# EAGLE design Drakula (EAGLE 9.6.2)
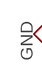
[diagram p0: schematic, sheet 1, part 1 of 3]
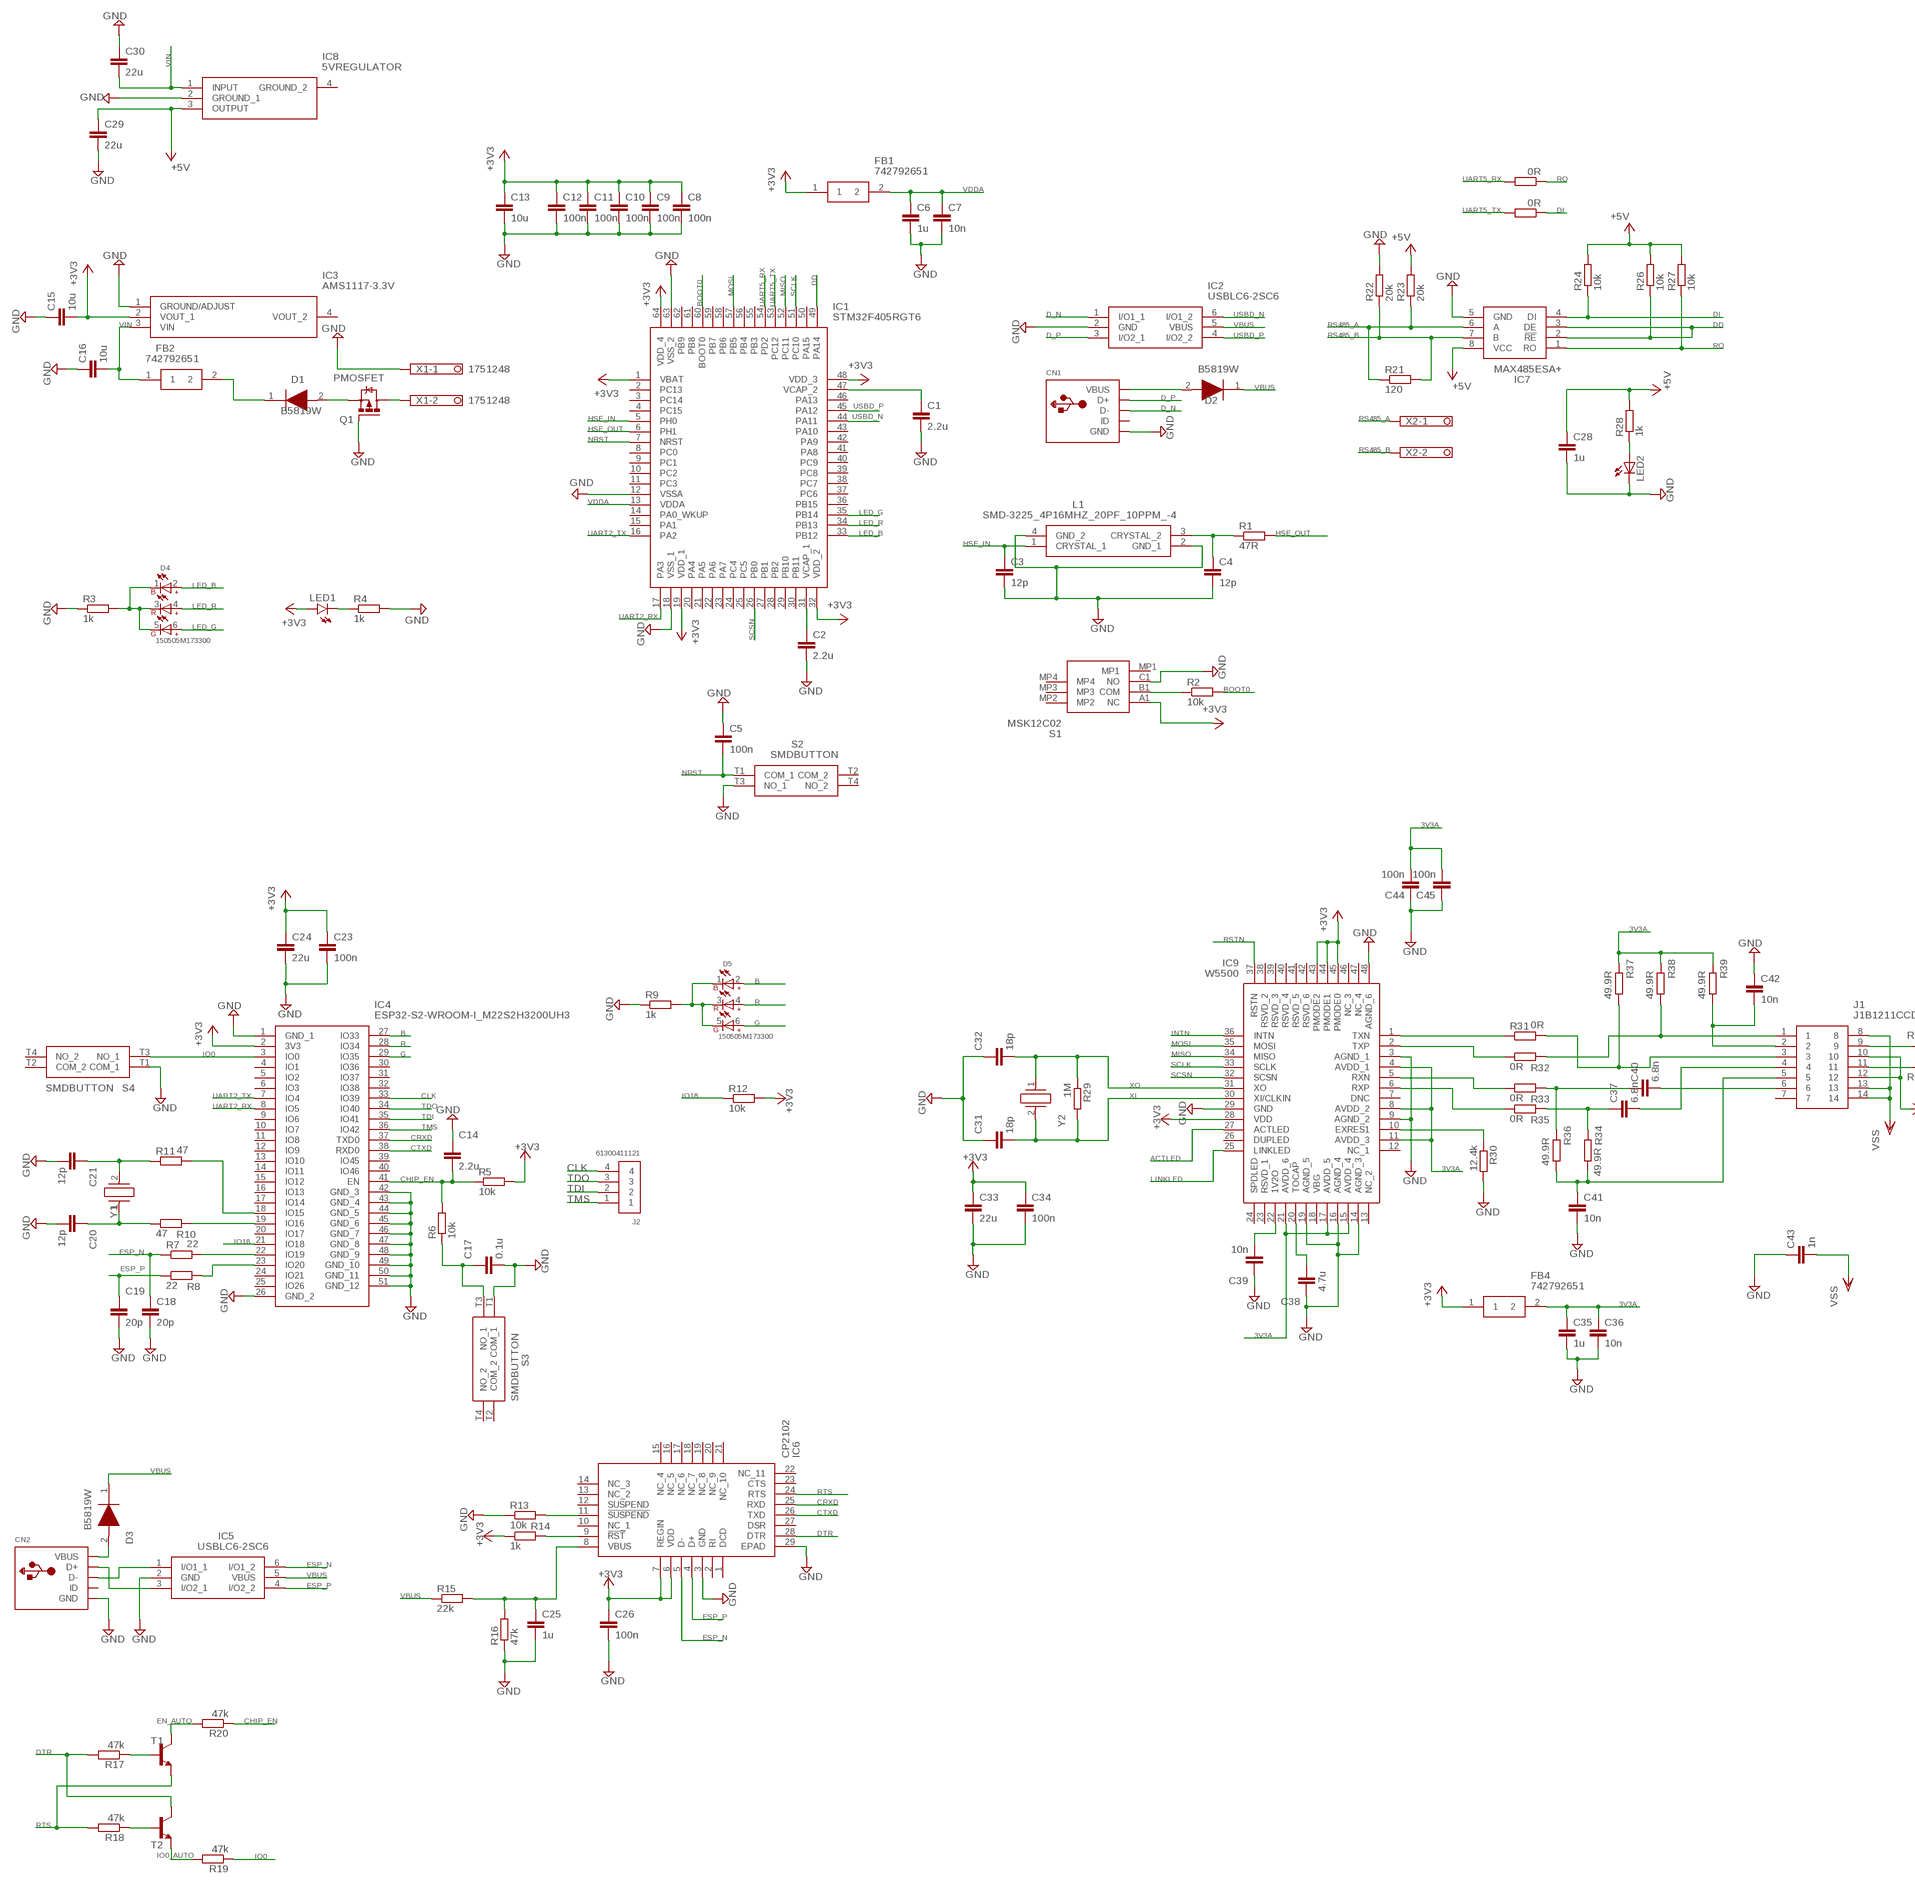
[diagram p1: schematic, sheet 1, part 2 of 3]
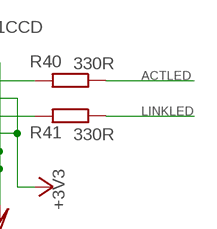
[diagram p2: schematic, sheet 1, part 3 of 3]

## Parts
C1  2.2u  C-EUC0603  [C0603]
C2  2.2u  C-EUC0603  [C0603]
C3  12p  C-EUC0603  [C0603]
C4  12p  C-EUC0603  [C0603]
C5  100n  C-EUC0603  [C0603]
C6  1u  C-EUC0603  [C0603]
C7  10n  C-EUC0603  [C0603]
C8  100n  C-EUC0603  [C0603]
C9  100n  C-EUC0603  [C0603]
C10  100n  C-EUC0603  [C0603]
C11  100n  C-EUC0603  [C0603]
C12  100n  C-EUC0603  [C0603]
C13  10u  C-EUC0603  [C0603]
C14  2.2u  C-EUC0603  [C0603]
C15  10u  C-EUC0603  [C0603]
C16  10u  C-EUC0603  [C0603]
C17  0.1u  C-EUC0603  [C0603]
C18  20p  C-EUC0603  [C0603]
C19  20p  C-EUC0603  [C0603]
C20  12p  C-EUC0603  [C0603]
C21  12p  C-EUC0603  [C0603]
C23  100n  C-EUC0603  [C0603]
C24  22u  C-EUC0603  [C0603]
C25  1u  C-EUC0603  [C0603]
C26  100n  C-EUC0603  [C0603]
C28  1u  C-EUC0603  [C0603]
C29  22u  C-EUC0805  [C0805]
C30  22u  C-EUC0805  [C0805]
C31  18p  C-EUC0603  [C0603]
C32  18p  C-EUC0603  [C0603]
C33  22u  C-EUC0805  [C0805]
C34  100n  C-EUC0805  [C0805]
C35  1u  C-EUC0603  [C0603]
C36  10n  C-EUC0603  [C0603]
C37  6.8n  C-EUC0603  [C0603]
C38  4.7u  C-EUC0603  [C0603]
C39  10n  C-EUC0603  [C0603]
C40  6.8n  C-EUC0603  [C0603]
C41  10n  C-EUC0603  [C0603]
C42  10n  C-EUC0603  [C0603]
C43  1n  C-EUC0603  [C0603]
C44  100n  C-EUC0603  [C0603]
C45  100n  C-EUC0603  [C0603]
CN1  USBMINIB  [USB-MINIB]
CN2  USBMINIB  [USB-MINIB]
D1  B5819W  [B5819W]
D2  B5819W  [B5819W]
D3  B5819W  [B5819W]
D4  150505M173300  WL-SFTW_5050_PLCC6_150505M173300  [WL-SFTW_5050_PLCC6]
D5  150505M173300  WL-SFTW_5050_PLCC6_150505M173300  [WL-SFTW_5050_PLCC6]
FB1  742792651  [BEADC1608X100N]
FB2  742792651  [BEADC1608X100N]
FB4  742792651  [BEADC1608X100N]
IC1  STM32F405RGT6  [STM32F405RTG6]
IC2  USBLC6-2SC6  [USBLC6]
IC3  AMS1117-3.3V  [SOT229P700X180-4N]
IC4  ESP32-S2-WROOM-I_M22S2H3200UH3  [ESP32S2]
IC5  USBLC6-2SC6  [USBLC6]
IC6  CP2102  [CP2102]
IC7  MAX485ESA+  [MAX485]
IC8  5VREGULATOR  [SOT23-5V]
IC9  W5500  [W5500]
J1  J1B1211CCD  [RJ45]
J2  61300411121  [61300411121]
L1  SMD-3225_4P16MHZ_20PF_10PPM_-4  [SMD3225_4P16MHZ20PF10PPM4085]
LED1  LEDCHIPLED_0603  [CHIPLED_0603]
LED2  LEDCHIPLED_0603  [CHIPLED_0603]
Q1  PMOSFET  PMOSFET_SOT23-GSD  [SOT23]
R1  47R  R-EU_R0603  [R0603]
R2  10k  R-EU_R0603  [R0603]
R3  1k  R-EU_R0805  [R0805]
R4  1k  R-EU_R0805  [R0805]
R5  10k  R-EU_R0603  [R0603]
R6  10k  R-EU_R0603  [R0603]
R7  22  R-EU_R0603  [R0603]
R8  22  R-EU_R0603  [R0603]
R9  1k  R-EU_R0805  [R0805]
R10  47  R-EU_R0603  [R0603]
R11  47  R-EU_R0603  [R0603]
R12  10k  R-EU_R0603  [R0603]
R13  10k  R-EU_R0805  [R0805]
R14  1k  R-EU_R0805  [R0805]
R15  22k  R-EU_R0805  [R0805]
R16  47k  R-EU_R0805  [R0805]
R17  47k  R-EU_R0805  [R0805]
R18  47k  R-EU_R0805  [R0805]
R19  47k  R-EU_R0805  [R0805]
R20  47k  R-EU_R0805  [R0805]
R21  120  R-EU_R0603  [R0603]
R22  20k  R-EU_R0603  [R0603]
R23  20k  R-EU_R0603  [R0603]
R24  10k  R-EU_R0603  [R0603]
R26  10k  R-EU_R0603  [R0603]
R27  10k  R-EU_R0603  [R0603]
R28  1k  R-EU_R0603  [R0603]
R29  1M  R-EU_R0603  [R0603]
R30  12.4k  R-EU_R0603  [R0603]
R31  0R  R-EU_R0603  [R0603]
R32  0R  R-EU_R0603  [R0603]
R33  0R  R-EU_R0603  [R0603]
R34  49.9R  R-EU_R0603  [R0603]
R35  0R  R-EU_R0603  [R0603]
R36  49.9R  R-EU_R0603  [R0603]
R37  49.9R  R-EU_R0603  [R0603]
R38  49.9R  R-EU_R0603  [R0603]
R39  49.9R  R-EU_R0603  [R0603]
R40  330R  R-EU_R0603  [R0603]
R41  330R  R-EU_R0603  [R0603]
R42  0R  R-EU_R0603  [R0603]
R43  0R  R-EU_R0603  [R0603]
S1  MSK12C02  [MSK12C02]
S2  SMDBUTTON  [SMDBUTTON]
S3  SMDBUTTON  [SMDBUTTON]
S4  SMDBUTTON  [SMDBUTTON]
T1  -NPN-SOT23-EBC  [SOT23-EBC]
T2  -NPN-SOT23-EBC  [SOT23-EBC]
X1  1751248  [1751248]
X2  1751248  [1751248]
Y1  FC-135R_32.7680KA-A0  [FC135R]
Y2  ABM3-25.000MHZ-B2-T  [ABM325000MHZB2T]

## Nets
3V3A: C35.1 C36.1 C44.2 C45.2 FB4.2 IC9.4(AVDD_1) IC9.8(AVDD_2) IC9.11(AVDD_3) IC9.15(AVDD_4) IC9.17(AVDD_5) IC9.21(AVDD_6) R37.2 R38.2 R39.2
+3V3: C8.1 C9.1 C10.1 C11.1 C12.1 C13.1 C15.2 C23.1 C24.1 C26.1 C33.1 C34.1 FB1.1 FB4.1 IC1.1(VBAT) IC1.19(VDD_1) IC1.32(VDD_2) IC1.48(VDD_3) IC1.64(VDD_4) IC3.2(VOUT_1) IC4.2(3V3) IC6.6(VDD) IC6.7(REGIN) IC9.28(VDD) IC9.43(PMODE2) IC9.44(PMODE1) IC9.45(PMODE0) J1.10 J1.12 LED1.A R5.2 R12.2 R14.1 S1.A1(NC)
+5V: C28.1 C29.1 IC7.8(VCC) IC8.3(OUTPUT) R23.2 R24.2 R26.2 R27.2 R28.2
ACTLED: IC9.27(ACTLED) R40.1
B: D5.2(B+) IC4.27(IO33)
BOOT0: IC1.60(BOOT0) R2.2
CHIP_EN: C14.2 IC4.41(EN) R5.1 R6.2 R20.1
CLK: IC4.33(IO39) J2.4
CRXD: IC4.37(TXD0) IC6.25(RXD)
CTXD: IC4.38(RXD0) IC6.26(TXD)
D_N: CN1.D- IC2.1(I/O1_1)
D_P: CN1.D+ IC2.3(I/O2_1)
DD: IC1.49(PA14) IC7.2(!RE) IC7.3(DE) R26.1
DI: IC7.4(DI) R24.1 R43.1
DTR: IC6.28(DTR) R17.2 T2.C
EN_AUTO: R20.2 T1.C
ESP_N: C18.1 IC5.6(I/O1_2) IC6.5(D-) R7.1
ESP_P: C19.1 IC5.4(I/O2_2) IC6.4(D+) R8.1
G: D5.6(G+) IC4.29(IO35)
GND: C1.2 C2.2 C3.2 C4.2 C5.1 C6.2 C7.2 C8.2 C9.2 C10.2 C11.2 C12.2 C13.2 C14.1 C15.1 C16.1 C17.2 C18.2 C19.2 C20.2 C21.2 C23.2 C24.2 C25.2 C26.2 C28.2 C29.2 C30.1 C31.1 C32.1 C33.2 C34.2 C35.2 C36.2 C38.1 C39.1 C41.2 C42.1 C43.1 C44.1 C45.1 CN1.GND CN2.GND IC1.12(VSSA) IC1.18(VSS_1) IC1.63(VSS_2) IC2.2(GND) IC3.1(GROUND/ADJUST) IC4.1(GND_1) IC4.26(GND_2) IC4.42(GND_3) IC4.43(GND_4) IC4.44(GND_5) IC4.45(GND_6) IC4.46(GND_7) IC4.47(GND_8) IC4.48(GND_9) IC4.49(GND_10) IC4.50(GND_11) IC4.51(GND_12) IC5.2(GND) IC6.3(GND) IC6.29(EPAD) IC7.5(GND) IC8.2(GROUND_1) IC9.3(AGND_1) IC9.9(AGND_2) IC9.14(AGND_3) IC9.16(AGND_4) IC9.19(AGND_5) IC9.29(GND) IC9.48(AGND_6) L1.2(GND_1) L1.4(GND_2) LED2.C Q1.1(G) R3.1 R4.2 R9.1 R13.1 R16.1 R22.2 R30.2 S1.C1(NO) S2.T3(NO_1) S3.T1(COM_1) S4.T1(COM_1) X1.1
HSE_IN: C3.1 IC1.5(PH0) L1.1(CRYSTAL_1)
HSE_OUT: IC1.6(PH1) R1.2
INTN: IC9.36(INTN)
IO0: IC4.3(IO0) R19.1 S4.T3(NO_1)
IO0_AUTO: R19.2 T2.E
IO18: IC4.21(IO18) R12.1
LED_B: D4.2(B+) IC1.33(PB12)
LED_G: D4.6(G+) IC1.35(PB14)
LED_R: D4.4(R+) IC1.34(PB13)
LINKLED: IC9.25(LINKLED) R41.1
MISO: IC1.52(PC11) IC9.34(MISO)
MOSI: IC1.57(PB5) IC9.35(MOSI)
N$1: Q1.3(D) X1.2
N$2: D1.1(K) FB2.2
N$3: D1.2(A) Q1.2(S)
N$4: D4.1(B-) D4.3(R-) D4.5(G-) R3.2
N$5: R2.1 S1.B1(COM)
N$6: LED1.C R4.1
N$8: C17.1 R6.1 S3.T3(NO_1)
N$10: CN2.D- IC5.1(I/O1_1)
N$11: CN2.D+ IC5.3(I/O2_1)
N$12: CN2.VBUS D3.2(A)
N$13: CN1.VBUS D2.2(A)
N$14: IC4.22(IO19) R7.2
N$15: IC4.23(IO20) R8.2
N$16: IC4.18(IO15) R11.2
N$17: C2.1 IC1.31(VCAP_1)
N$18: C1.1 IC1.47(VCAP_2)
N$19: IC4.19(IO16) R10.2
N$20: C4.1 L1.3(CRYSTAL_2) R1.1
N$21: C20.1 R10.1 Y1.1
N$22: C21.1 R11.1 Y1.2
N$23: C25.1 IC6.8(VBUS) R15.2 R16.2
N$24: IC6.11(!SUSPEND) R13.2
N$25: IC6.9(!RST) R14.2
N$26: D5.1(B-) D5.3(R-) D5.5(G-) R9.2
N$29: R17.1 T1.B
N$30: R18.1 T2.B
N$31: C39.2 IC9.22(1V2O)
N$32: C38.2 IC9.20(TOCAP)
N$33: LED2.A R28.1
N$34: IC9.10(EXRES1) R30.1
N$35: IC9.1(TXN) R31.1
N$36: IC9.2(TXP) R32.1
N$37: IC9.5(RXN) R33.1
N$38: IC9.6(RXP) R35.1
N$39: J1.1 R32.2 R38.1
N$40: J1.3 R31.2 R37.1
N$41: C40.2 J1.6
N$42: C37.2 J1.4
N$43: C37.1 R34.2 R35.2
N$44: C40.1 R33.2 R36.2
N$45: C41.1 J1.5 R34.1 R36.1
N$46: J1.9 R40.2
N$47: C42.2 J1.2 R39.1
N$48: J1.11 R41.2
NRST: C5.2 IC1.7(NRST) S2.T1(COM_1)
R: D5.4(R+) IC4.28(IO34)
RO: IC7.1(RO) R27.1 R42.1
RS485_A: IC7.6(A) R21.1 R23.1 X2.1
RS485_B: IC7.7(B) R21.2 R22.1 X2.2
RSTN: IC9.37(RSTN)
RTS: IC6.24(RTS) R18.2 T1.E
SCLK: IC1.51(PC10) IC9.33(SCLK)
SCSN: IC1.26(PB0) IC9.32(SCSN)
TDI: IC4.35(IO41) J2.2
TDO: IC4.34(IO40) J2.3
TMS: IC4.36(IO42) J2.1
UART2_RX: IC1.17(PA3) IC4.8(IO5)
UART2_TX: IC1.16(PA2) IC4.7(IO4)
UART5_RX: IC1.54(PD2) R42.2
UART5_TX: IC1.53(PC12) R43.2
USBD_N: IC1.44(PA11) IC2.6(I/O1_2)
USBD_P: IC1.45(PA12) IC2.4(I/O2_2)
VBUS: D2.1(K) D3.1(K) IC2.5(VBUS) IC5.5(VBUS) R15.1
VDDA: C6.1 C7.1 FB1.2 IC1.13(VDDA)
VIN: C16.2 C30.2 FB2.1 IC3.3(VIN) IC8.1(INPUT)
VSS: C43.2 J1.8 J1.13 J1.14
XI: C31.2 IC9.30(XI/CLKIN) R29.2 Y2.2
XO: C32.2 IC9.31(XO) R29.1 Y2.1
Unconnected: CN1.ID CN2.ID IC1.2(PC13) IC1.3(PC14) IC1.4(PC15) IC1.8(PC0) IC1.9(PC1) IC1.10(PC2) IC1.11(PC3) IC1.14(PA0_WKUP) IC1.15(PA1) IC1.20(PA4) IC1.21(PA5) IC1.22(PA6) IC1.23(PA7) IC1.24(PC4) IC1.25(PC5) IC1.27(PB1) IC1.28(PB2) IC1.29(PB10) IC1.30(PB11) IC1.36(PB15) IC1.37(PC6) IC1.38(PC7) IC1.39(PC8) IC1.40(PC9) IC1.41(PA8) IC1.42(PA9) IC1.43(PA10) IC1.46(PA13) IC1.50(PA15) IC1.55(PB3) IC1.56(PB4) IC1.58(PB6) IC1.59(PB7) IC1.61(PB8) IC1.62(PB9) IC3.4(VOUT_2) IC4.4(IO1) IC4.5(IO2) IC4.6(IO3) IC4.9(IO6) IC4.10(IO7) IC4.11(IO8) IC4.12(IO9) IC4.13(IO10) IC4.14(IO11) IC4.15(IO12) IC4.16(IO13) IC4.17(IO14) IC4.20(IO17) IC4.24(IO21) IC4.25(IO26) IC4.30(IO36) IC4.31(IO37) IC4.32(IO38) IC4.39(IO45) IC4.40(IO46) IC6.1(DCD) IC6.2(RI) IC6.10(NC_1) IC6.12(SUSPEND) IC6.13(NC_2) IC6.14(NC_3) IC6.15(NC_4) IC6.16(NC_5) IC6.17(NC_6) IC6.18(NC_7) IC6.19(NC_8) IC6.20(NC_9) IC6.21(NC_10) IC6.22(NC_11) IC6.23(CTS) IC6.27(DSR) IC8.4(GROUND_2) IC9.7(DNC) IC9.12(NC_1) IC9.13(NC_2) IC9.18(VBG) IC9.23(RSVD_1) IC9.24(SPDLED) IC9.26(DUPLED) IC9.38(RSVD_2) IC9.39(RSVD_3) IC9.40(RSVD_4) IC9.41(RSVD_5) IC9.42(RSVD_6) IC9.46(NC_3) IC9.47(NC_4) J1.7 S1.MP1 S1.MP2 S1.MP3 S1.MP4 S2.T2(COM_2) S2.T4(NO_2) S3.T2(COM_2) S3.T4(NO_2) S4.T2(COM_2) S4.T4(NO_2)

## Library data of the parts
C1-C21 C23-C26 C28-C45 = rcl:C-EU: CAPACITOR, European symbol; SPICEPREFIX: C
CN1 CN2 = adafruit:USB: USB Connectors USBMINIB - Surface Mount Female Mini-B USB Connector 4UConnector: 06564 By microbuilder.eu Thru-hole RA Female Mini-B USB Connector 4UConnector: 18732 By ladyada.net
D1-D3 = B5819W:B5819W: 40V 1A 600mV @ 1A SOD-123 Schottky Barrier Diodes (SBD) Source: Datasheet <https://datasheet.lcsc.com/szlcsc/Changjiang-Electronics-Tech-CJ-B5819W_C8598.pdf>; DESCRIPTION: 40V 1A 600mV @ 1A SOD-123 Schottky Barrier Diodes (SBD); HEIGHT: 1.25mm; MANUFACTURER_NAME: Changjiang Electronics Tech (CJ); MANUFACTURER_PART_NUMBER: B5819W
D4 D5 = Wurth_LEDs_WL-SFTW:WL-SFTW_5050_PLCC6: WL-SFTW SMT Full-color TOP LED Waterclear Characteristics Low energy consumption High reliability Low current requirement Fast switching No UV/IR radiation High brightness RGB individual control Compact package outline LED with Black surface Applications Flash light Switch indicators Equipment indicators Accent and decorative lighting Electronic signage Video displays Backlight for LCDs, PDAs and TVs Oven, microwave Street lighting Ideal for lateral coupling in light guides <https://www.we-online.com/catalog/media/o14903v209%20Family_WL-SFTW-neu.jpg> Details see: www.we-online.com/catalog/WL-SFTW <www.we-online.com/catalog/WL-SFTW/?utm_source=eagle_model&utm_medium=description_link&utm_campaign=eisos_eagle> Updated by Ella 2022-06-20 2022(C) Wurth Elektronik; CHIP-TECHNOLOGY: AlInGaP + InGaN; DATASHEET-URL: https://www.we-online.com/redexpert/spec/150505M173300?ae; DOMINANT-WAVELENGTH: 625nm@Red / 520nm@Green / 470nm@Blue; EMITTING-COLOR: Red & Green & Blue; FORWARD-VOLTAGE: 2V@Red / 3.2V@Green / 3.2V@Blue; LUMINOUS-INTENSITY: 800nm@Red / 1300mcd@Green / 350mcd@Blue; MOUNT: SMT; PART-NUMBER: 150505M173300; PEAK-WAVELENGTH: 635nm@Red / 515nm@Green / 465nm@Blue; VIEWING-ANGLE: 120°
FB1 FB2 FB4 = ferrite bead:742792651: WE-CBF Ferrite Bead 0603 600Ohm 1000mA WE-CBF Ferrite Bead 0603 600Ohm 1000mA Source: Datasheet <https://datasheet.datasheetarchive.com/originals/distributors/Datasheets_SAMA/48062ffb9caf49acf8bdc538db0cfb17.pdf>; DESCRIPTION: WE-CBF Ferrite Bead 0603 600Ohm 1000mA WE-CBF Ferrite Bead 0603 600Ohm 1000mA; HEIGHT: 1mm; MANUFACTURER_NAME: Wurth Elektronik; MANUFACTURER_PART_NUMBER: 742792651; MOUSER_PART_NUMBER: 710-742792651; MOUSER_PRICE-STOCK: https://www.mouser.co.uk/ProductDetail/Wurth-Elektronik/742792651?qs=5twSNpOB8IDs0LGakhqBZQ%3D%3D
IC1 = STM32F405RGT6:STM32F405RGT6: MCU 32-Bit, ARM Cortex M4, 1MB Flash STMicroelectronics STM32F405RGT6, 32bit ARM Cortex M4F Microcontroller, 168MHz, 1024 kB Flash, 64-Pin LQFP Source: Datasheet <http://www.st.com/web/en/resource/technical/document/datasheet/DM00037051.pdf>; ARROW_PART_NUMBER: STM32F405RGT6; ARROW_PRICE-STOCK: https://www.arrow.com/en/products/stm32f405rgt6/stmicroelectronics?region=nac; DESCRIPTION: MCU 32-Bit, ARM Cortex M4, 1MB Flash STMicroelectronics STM32F405RGT6, 32bit ARM Cortex M4F Microcontroller, 168MHz, 1024 kB Flash, 64-Pin LQFP; HEIGHT: 1.6mm; MANUFACTURER_NAME: STMicroelectronics; MANUFACTURER_PART_NUMBER: STM32F405RGT6; MOUSER_PART_NUMBER: 511-STM32F405RGT6; MOUSER_PRICE-STOCK: https://www.mouser.co.uk/ProductDetail/STMicroelectronics/STM32F405RGT6?qs=Z8%252BeY1k3TIKgj7QWsYGpQw%3D%3D
IC2 IC5 = USBLC6-2SC6:USBLC6-2SC6: TVS Diode Array Uni-Directional USBLC6-2SC6 17V, SOT-23 6-Pin Source: Datasheet <http://www.st.com/st-web-ui/static/active/en/resource/technical/document/datasheet/CD00050750.pdf>; ARROW_PART_NUMBER: USBLC6-2SC6; ARROW_PRICE-STOCK: https://www.arrow.com/en/products/usblc6-2sc6/stmicroelectronics?region=nac; DESCRIPTION: TVS Diode Array Uni-Directional USBLC6-2SC6 17V, SOT-23 6-Pin; HEIGHT: 1.45mm; MANUFACTURER_NAME: STMicroelectronics; MANUFACTURER_PART_NUMBER: USBLC6-2SC6; MOUSER_PART_NUMBER: 511-USBLC6-2SC6; MOUSER_PRICE-STOCK: https://www.mouser.co.uk/ProductDetail/STMicroelectronics/USBLC6-2SC6?qs=po45yt2pPpu%2FhNIlwQdTlg%3D%3D
IC3 = ams1117-3.3v:AMS1117-3.3V: 1A LOW DROPOUT VOLTAGE REGULATOR, SOT-223 Source: Datasheet <http://www.advanced-monolithic.com/pdf/ds1117.pdf>; DESCRIPTION: 1A LOW DROPOUT VOLTAGE REGULATOR, SOT-223; HEIGHT: 1.8mm; MANUFACTURER_NAME: Advanced Monolithic Systems; MANUFACTURER_PART_NUMBER: ams1117-3.3v
IC4 = ESP32-S2-WROOM-I_M22S2H3200UH3:ESP32-S2-WROOM-I_M22S2H3200UH3: WiFi Modules (802.11) Module ESP32-S2 WROOM IPEX ANT Source: Datasheet <https://www.espressif.com/sites/default/files/documentation/esp32-s2-wroom_esp32-s2-wroom-i_datasheet_en.pdf>; DESCRIPTION: WiFi Modules (802.11) Module ESP32-S2 WROOM IPEX ANT; HEIGHT: 3.45mm; MANUFACTURER_NAME: Espressif Systems; MANUFACTURER_PART_NUMBER: ESP32-S2-WROOM-I(M22S2H3200UH3Q0); MOUSER_PART_NUMBER: 356-ESP32S2WRMI320UH; MOUSER_PRICE-STOCK: https://www.mouser.co.uk/ProductDetail/Espressif-Systems/ESP32-S2-WROOM-IM22S2H3200UH3Q0?qs=vHuUswq2%252BswK%2FNdFP9puyg%3D%3D
IC6 = CP2102:CP2102: USB Interface IC Source: Datasheet <https://componentsearchengine.com/Datasheets/1/CP2102.pdf>; DESCRIPTION: USB Interface IC; HEIGHT: 1mm; MANUFACTURER_NAME: Silicon Labs; MANUFACTURER_PART_NUMBER: CP2102; MOUSER_PART_NUMBER: 634-CP2102; MOUSER_PRICE-STOCK: https://www.mouser.co.uk/ProductDetail/Silicon-Labs/CP2102?qs=ucY0lxHzU7615lOm95XT0w%3D%3D
IC7 = MAX485ESA+:MAX485ESA+: MAX485ESA+, Line Transceiver, RS-485, RS-422 2.5 Mbit/s Differential, 4.75 5.25 V, 8-Pin SOIC Source: Datasheet <http://datasheets.maximintegrated.com/en/ds/MAX1487-MAX491.pdf>; ARROW_PART_NUMBER: MAX485ESA+; ARROW_PRICE-STOCK: https://www.arrow.com/en/products/max485esa/maxim-integrated?region=nac; DESCRIPTION: MAX485ESA+, Line Transceiver, RS-485, RS-422 2.5 Mbit/s Differential, 4.75 5.25 V, 8-Pin SOIC; HEIGHT: 1.75mm; MANUFACTURER_NAME: Maxim Integrated; MANUFACTURER_PART_NUMBER: MAX485ESA+; MOUSER_PART_NUMBER: 700-MAX485ESA; MOUSER_PRICE-STOCK: https://www.mouser.co.uk/ProductDetail/Maxim-Integrated/MAX485ESA%2b?qs=1THa7WoU59HHuBnHtoz5mw%3D%3D
IC8 = NCV2931AST-5T3G:5VREGULATOR: LDO Regulator Pos 5V 0.1A Automotive 4-Pin(3+Tab) SOT-223 T/R Source: Datasheet <https://www.mouser.com/datasheet/2/308/LM2931-D-30111.pdf>; DESCRIPTION: LDO Regulator Pos 5V 0.1A Automotive 4-Pin(3+Tab) SOT-223 T/R; HEIGHT: 1.8mm; MANUFACTURER_NAME: onsemi; MANUFACTURER_PART_NUMBER: NCV2931AST-5T3G; MOUSER_PART_NUMBER: 863-NCV2931AST-5T3G; MOUSER_PRICE-STOCK: https://www.mouser.co.uk/ProductDetail/ON-Semiconductor/NCV2931AST-5T3G?qs=8sOby8ZxZLGq7jO3LofrqA%3D%3D
IC9 = W5500:W5500: Ethernet ICs 3in1 Enet Controller TCP/IP +MAC+PHY Source: Datasheet <http://wizwiki.net/wiki/lib/exe/fetch.php?media=products:w5500:w5500_ds_v106e_141230.pdf>; DESCRIPTION: Ethernet ICs 3in1 Enet Controller TCP/IP +MAC+PHY; HEIGHT: 1.6mm; MANUFACTURER_NAME: WIZnet Inc; MANUFACTURER_PART_NUMBER: W5500; MOUSER_PART_NUMBER: 950-W5500; MOUSER_PRICE-STOCK: https://www.mouser.co.uk/ProductDetail/WIZnet/W5500?qs=2vh%252B45pPFtzthUpYPd4pqA%3D%3D
J1 = rj45:J1B1211CCD: Modules Accessories RJ-45 w/ Transformer Connector /CETUS Source: Datasheet <http://wizwiki.net/wiki/lib/exe/fetch.php?media=products:wiz550web:wiz550webds_kr:j1b1211ccd.pdf>; DESCRIPTION: Modules Accessories RJ-45 w/ Transformer Connector /CETUS; HEIGHT: 13.6mm; MANUFACTURER_NAME: WIZnet Inc; MANUFACTURER_PART_NUMBER: J1B1211CCD; MOUSER_PART_NUMBER: 950-J1B1211CCD; MOUSER_PRICE-STOCK: https://www.mouser.co.uk/ProductDetail/WIZnet/J1B1211CCD?qs=6pHq9bjOlanFLUlTDcmBeQ%3D%3D
J2 = Headers:61300411121: CONN HEADER VERT 4POS 2.54MM Manufacturer's datasheet <https://katalog.we-online.de/em/datasheet/6130xx11121.pdf>; CREATED_BY: PCBLayout.com; DIGI_KEY_PART_NUMBER: 732-5317-ND; MANUFACTURER: Wurth Electronics Inc.; MPN: 61300411121
L1 = SMD-3225_4p_clock:SMD-3225_4P16MHZ_20PF_10PPM_-4: SMD-3225_4P16MHZ 20PF 10PPM -40~+85 Source: Datasheet <https://datasheet.lcsc.com/szlcsc/Zhejiang-Abel-Elec-SMD-3225-4P-16MHz-20pF-10ppm-40-85_C164049.pdf>; DESCRIPTION: SMD-3225_4P16MHZ 20PF 10PPM -40~+85; HEIGHT: 0.8mm; MANUFACTURER_NAME: TAE(Zhejiang Abel Elec); MANUFACTURER_PART_NUMBER: SMD-3225_4P16MHZ 20PF 10PPM -40~+85℃
LED1 = led:LED: LED
LED2 = adafruit:LED: LED
Q1 = Transistor:PMOSFET: P-Channel MOSFET - Generic; CATEGORY: Transistor; SUB-CATEGORY: MOSFET; TYPE: P-Channel
R1-R24 R26-R43 = rcl:R-EU_: RESISTOR, European symbol; SPICEPREFIX: R
S1 = MSK12C02 SPDT:MSK12C02: SMD Toggle Switches Source: Datasheet <https://shouhan.en.made-in-china.com/product/xsMEmqgOAXWB/China-Slide-Switch-Msk12c02-Slide-Switch-on-off-2-Position-1p2t-Spdt-Miniature-Horizontal-SMD-7p-Slide-Switch.html>; DESCRIPTION: SMD Toggle Switches; HEIGHT: 1.4mm; MANUFACTURER_NAME: Shou Han; MANUFACTURER_PART_NUMBER: MSK12C02
S2-S4 = SPST Button SMD:SMDBUTTON: Tactile Switches Surface mount tact 6.6mm /4.3mm / Brown Source: Datasheet <https://www.mouser.com/datasheet/2/26/ADTS6-ADTSM-KTSC6-263747-1158247.pdf>; DESCRIPTION: Tactile Switches Surface mount tact 6.6mm /4.3mm / Brown; HEIGHT: 4.3mm; MANUFACTURER_NAME: Apem; MANUFACTURER_PART_NUMBER: ADTSM61NVTR; MOUSER_PART_NUMBER: 642-ADTSM61NVTR; MOUSER_PRICE-STOCK: https://www.mouser.co.uk/ProductDetail/Apem/ADTSM61NVTR?qs=iGLABakYCr8tE6uSJ2f%2FWA%3D%3D
T1 T2 = transistor:*-NPN-: NPN Transistror BF959 corrected 2008.03.06
X1 X2 = con-phoenix-350:1751248: MKDS 1/ 2-3,5 Printklemme Nennstrom: 10 A Bemessungsspannung: 160 V Raster: 3,5 mm Polzahl: 2 Montageart: Löten Anschlussart: Schraubanschluss Anschlussrichtung vom Leiter zur Platine: 0° Source: http://eshop.phoenixcontact.com .. 1751248.pdf; OC_FARNELL: unknown; OC_NEWARK: unknown
Y1 = FC-135R_32.7680KA-A0:FC-135R_32.7680KA-A0: CRYSTAL 32.7680 KHZ 12.5PF SMD Source: Datasheet <https://support.epson.biz/td/api/doc_check.php?dl=brief_FC-135R&lang=en>; ARROW_PART_NUMBER: FC-135R 32.7680KA-A0; ARROW_PRICE-STOCK: https://www.arrow.com/en/products/fc-135r32.7680ka-a0/epson-electronics-america; DESCRIPTION: CRYSTAL 32.7680 KHZ 12.5PF SMD; HEIGHT: 0.9mm; MANUFACTURER_NAME: Epson Timing; MANUFACTURER_PART_NUMBER: FC-135R 32.7680KA-A0; MOUSER_PART_NUMBER: 732-5R32.7680KA-A0; MOUSER_PRICE-STOCK: https://www.mouser.co.uk/ProductDetail/Epson-Timing/FC-135R-327680KA-A0?qs=f9yNj16SXrJRNSRyvSQAPQ%3D%3D
Y2 = ABM3-25.000MHZ-B2-T:ABM3-25.000MHZ-B2-T: Crystals +/-20ppm 25MHZ Source: Datasheet <https://datasheet.datasheetarchive.com/originals/distributors/SFDatasheet-0/sf-000246.pdf>; ARROW_PART_NUMBER: ABM3-25.000MHZ-B2-T; ARROW_PRICE-STOCK: https://www.arrow.com/en/products/abm3-25.000mhz-b2-t/abracon; DESCRIPTION: Crystals +/-20ppm 25MHZ; HEIGHT: 1.3mm; MANUFACTURER_NAME: ABRACON; MANUFACTURER_PART_NUMBER: ABM3-25.000MHZ-B2-T; MOUSER_PART_NUMBER: 815-ABM3-25-B2-T; MOUSER_PRICE-STOCK: https://www.mouser.co.uk/ProductDetail/ABRACON/ABM3-25000MHZ-B2-T?qs=GgB7MJ%2FTIsQBQ7HNZGW3Hg%3D%3D

## Board
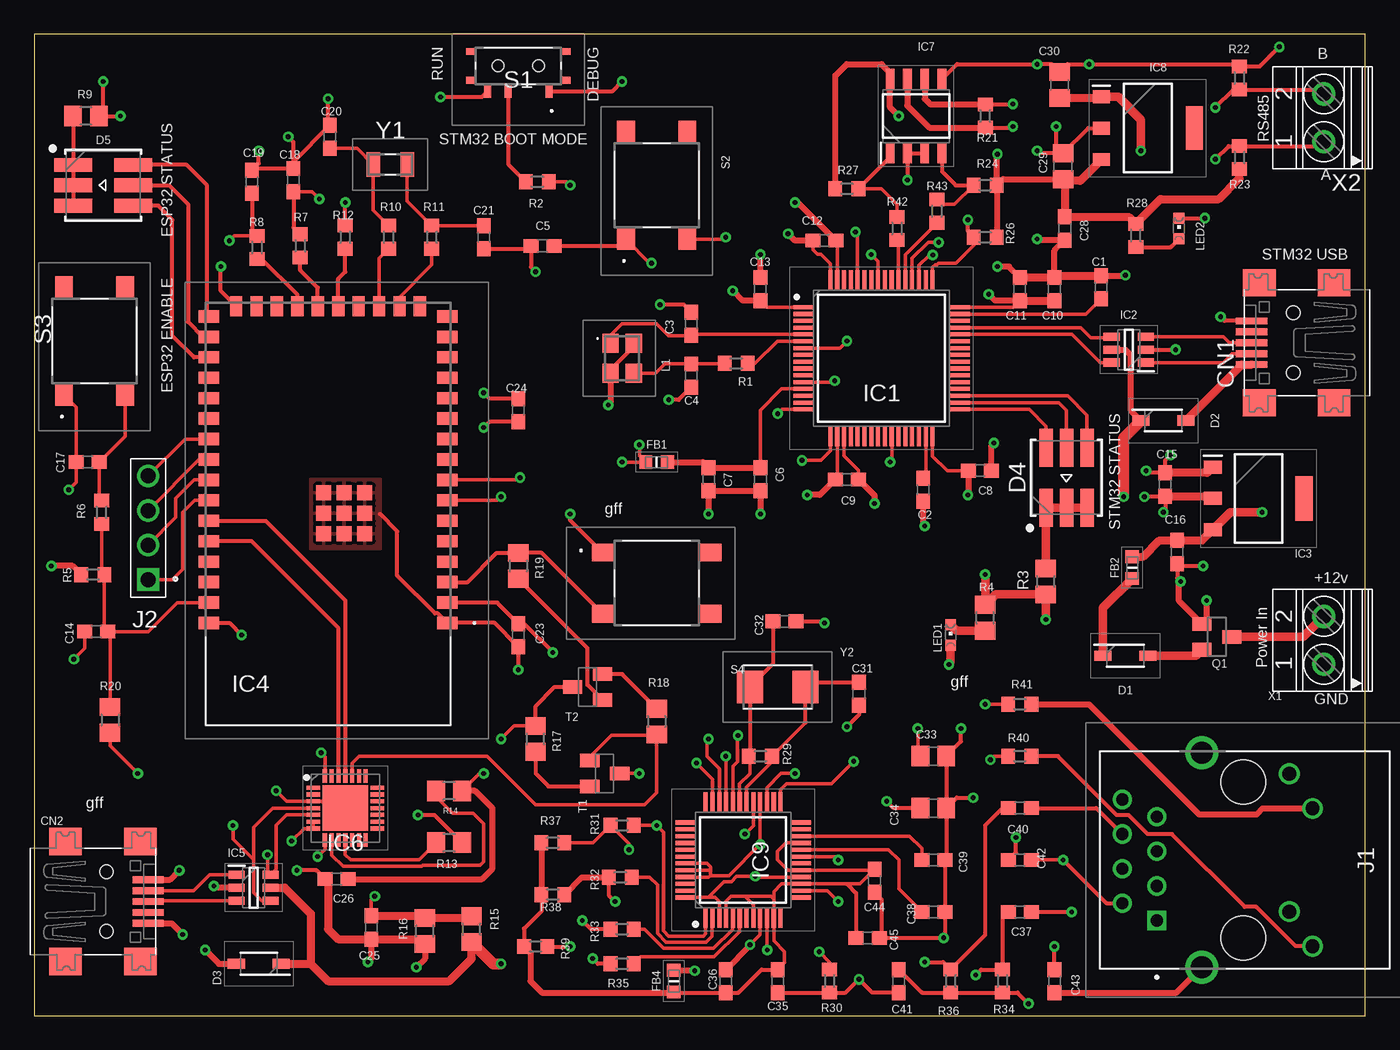
[diagram p3: board, top side]
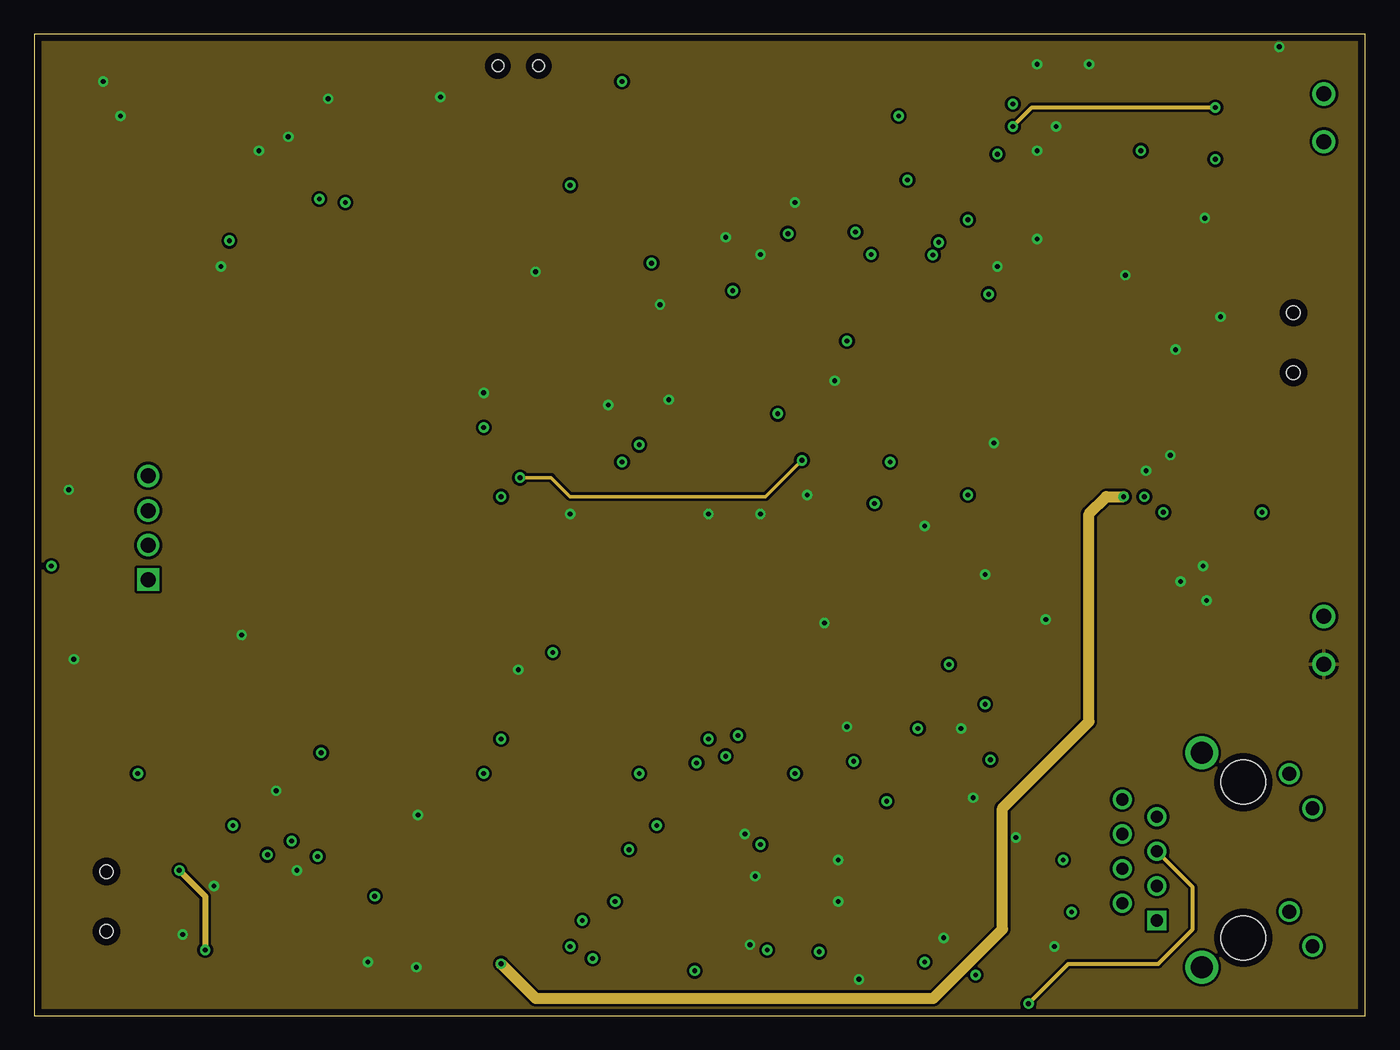
[diagram p4: board, inner layer Route2]
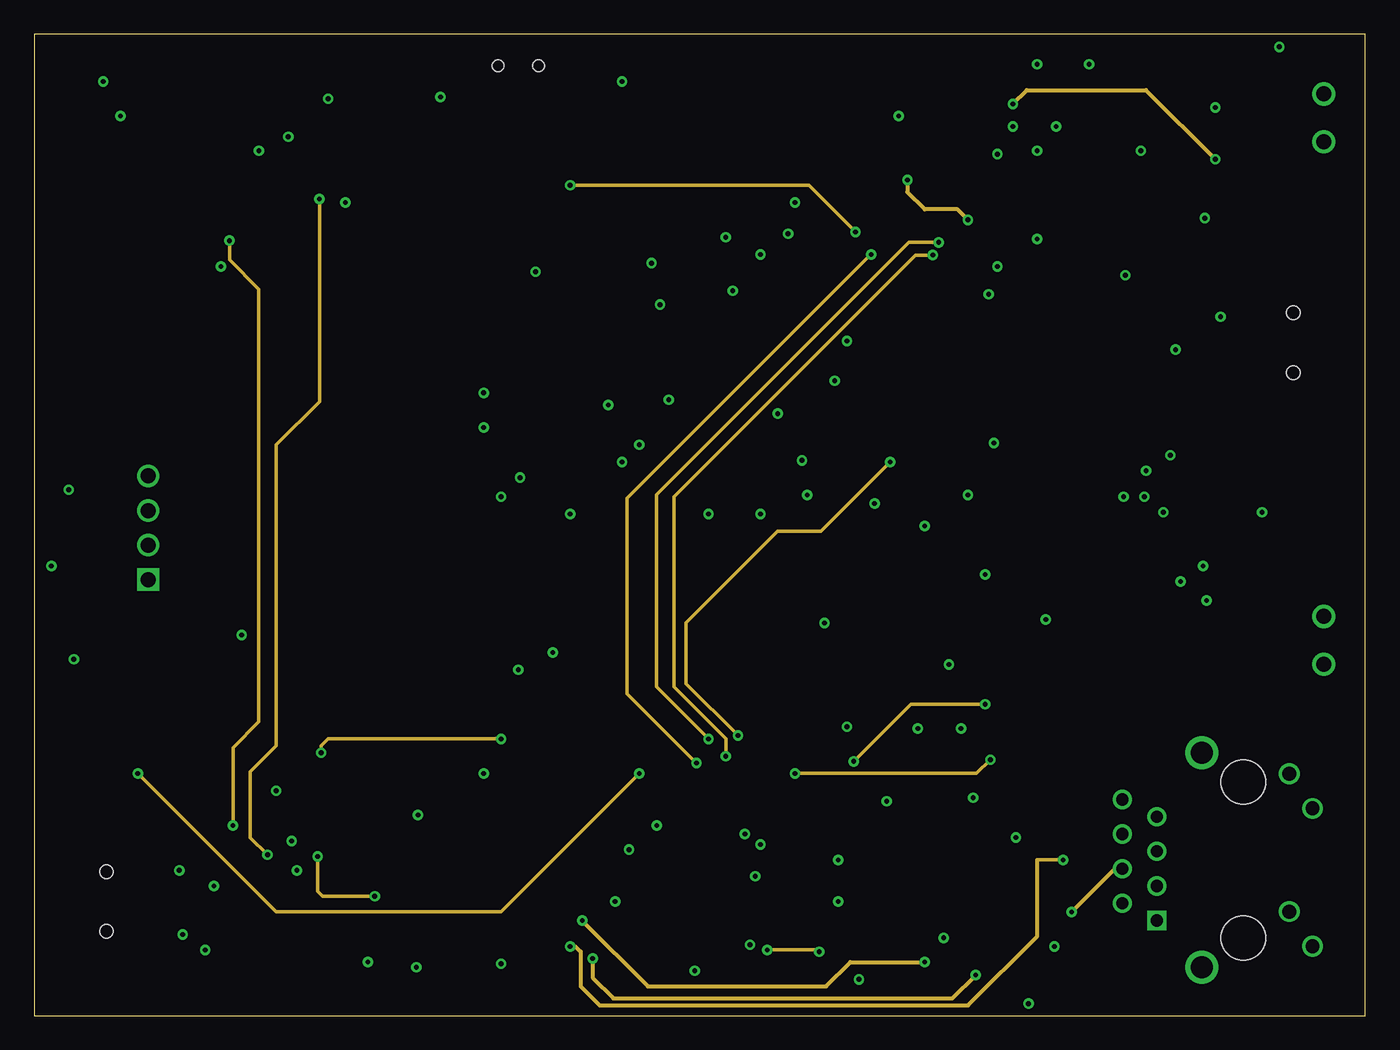
[diagram p5: board, inner layer Route15]
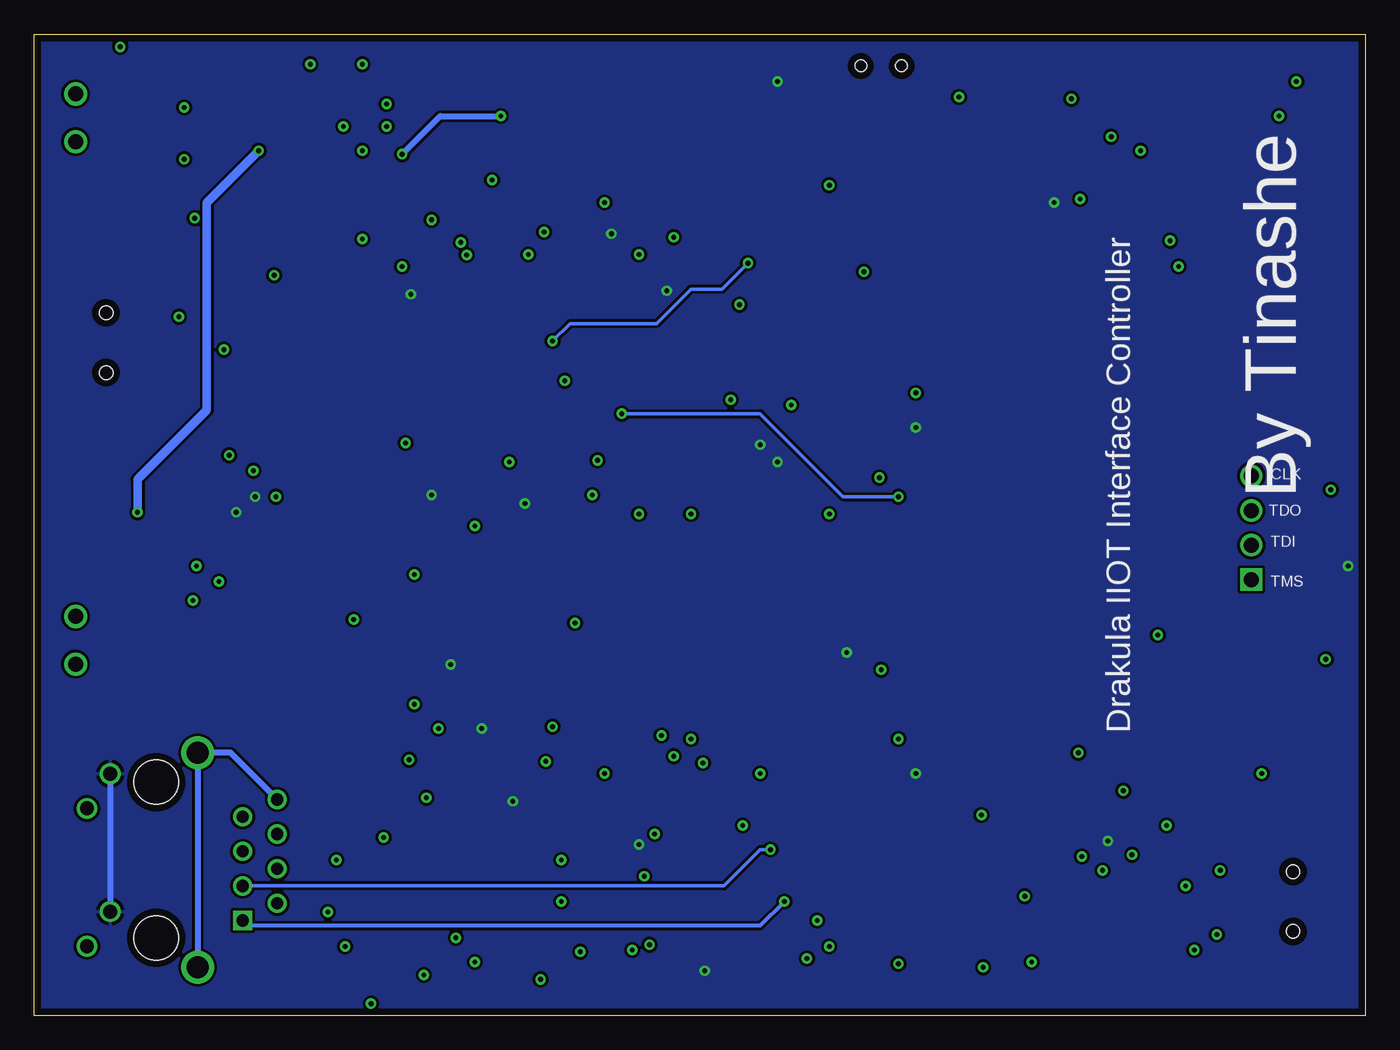
[diagram p6: board, bottom side, seen from below]

Size 97.77 x 72.06 mm. Coordinates in mm from the lower left corner, seen from the top.
Outline: 0,0 97.77,0 97.77,72.06 0,72.06 0,0
Copper layers (1+2*15+16): Top 0.035mm / dielectric 1.5mm / Route2 0.035mm / dielectric 0.15mm / Route15 0.035mm / dielectric 0.2mm / Bottom 0.035mm
Design rules "default *": minimum track width 0.2mm, minimum drill 0.35mm, track to track 0.2mm, track to pad 0.2mm, pad to pad 0.2mm, via to via 0.2mm, smd to smd 0.2mm, copper to edge 20mil, drill to drill 0.2mm, minimum pad ring 10mil, minimum via ring 8mil, stop-mask expansion 4mil, vias tented up to drill 0mil, thermal gap 10mil

### Footprints (pad centres in the part's own frame; a part is rotated, then mirrored left to right if it is on the bottom)
C0603 = smd 1.1 x 1: 1 -0.85,0; 2 0.85,0
C0805 = smd 1.3 x 1.5: 1 -0.95,0; 2 0.95,0
USB-MINIB = smd 0.5 x 2.308: D+ 0,4.064; D- -0.8,4.064; GND 1.6,4.064; ID 0.8,4.064; VBUS -1.6,4.064 | smd 2 x 2.4: GND1 -4.4,-2; GND2 -4.4,3.5; GND3 4.4,3.5; GND4 4.4,-2 | hole 1: -2.2,1; 2.2,1
B5819W = smd 1.25 x 0.75: 1 -1.65,0; 2 1.65,0
WL-SFTW_5050_PLCC6 = smd 2.8 x 1: 1 -2.2,1.5; 2 2.2,1.5; 3 -2.2,0; 4 2.2,0; 5 -2.2,-1.5; 6 2.2,-1.5
BEADC1608X100N = smd 0.95 x 1: 1 -0.8,0; 2 0.8,0
STM32F405RTG6 = smd 1.475 x 0.3: 1 -5.738,3.75; 2 -5.738,3.25; 3 -5.738,2.75; 4 -5.738,2.25; 5 -5.738,1.75; 6 -5.738,1.25; 7 -5.738,0.75; 8 -5.738,0.25; 9 -5.738,-0.25; 10 -5.738,-0.75; 11 -5.738,-1.25; 12 -5.738,-1.75; 13 -5.738,-2.25; 14 -5.738,-2.75; 15 -5.738,-3.25; 16 -5.738,-3.75; 33 5.738,-3.75; 34 5.738,-3.25; 35 5.738,-2.75; 36 5.738,-2.25; 37 5.738,-1.75; 38 5.738,-1.25; 39 5.738,-0.75; 40 5.738,-0.25; 41 5.738,0.25; 42 5.738,0.75; 43 5.738,1.25; 44 5.738,1.75; 45 5.738,2.25; 46 5.738,2.75; 47 5.738,3.25; 48 5.738,3.75 | smd 0.3 x 1.475: 17 -3.75,-5.738; 18 -3.25,-5.738; 19 -2.75,-5.738; 20 -2.25,-5.738; 21 -1.75,-5.738; 22 -1.25,-5.738; 23 -0.75,-5.738; 24 -0.25,-5.738; 25 0.25,-5.738; 26 0.75,-5.738; 27 1.25,-5.738; 28 1.75,-5.738; 29 2.25,-5.738; 30 2.75,-5.738; 31 3.25,-5.738; 32 3.75,-5.738; 49 3.75,5.738; 50 3.25,5.738; 51 2.75,5.738; 52 2.25,5.738; 53 1.75,5.738; 54 1.25,5.738; 55 0.75,5.738; 56 0.25,5.738; 57 -0.25,5.738; 58 -0.75,5.738; 59 -1.25,5.738; 60 -1.75,5.738; 61 -2.25,5.738; 62 -2.75,5.738; 63 -3.25,5.738; 64 -3.75,5.738
USBLC6 = smd 1.2 x 0.6: 1 -1.25,0.95; 2 -1.25,0; 3 -1.25,-0.95; 4 1.25,-0.95; 5 1.25,0; 6 1.25,0.95
SOT229P700X180-4N = smd 1.3 x 0.95: 1 -3.35,2.29; 2 -3.35,0; 3 -3.35,-2.29 | smd 1.3 x 3.25: 4 3.35,0
ESP32S2 = smd 1.5 x 0.9: 1 -8.75,8; 2 -8.75,6.5; 3 -8.75,5; 4 -8.75,3.5; 5 -8.75,2; 6 -8.75,0.5; 7 -8.75,-1; 8 -8.75,-2.5; 9 -8.75,-4; 10 -8.75,-5.5; 11 -8.75,-7; 12 -8.75,-8.5; 13 -8.75,-10; 14 -8.75,-11.5; 15 -8.75,-13; 16 -8.75,-14.5; 27 8.75,-14.5; 28 8.75,-13; 29 8.75,-11.5; 30 8.75,-10; 31 8.75,-8.5; 32 8.75,-7; 33 8.75,-5.5; 34 8.75,-4; 35 8.75,-2.5; 36 8.75,-1; 37 8.75,0.5; 38 8.75,2; 39 8.75,3.5; 40 8.75,5; 41 8.75,6.5; 42 8.75,8 | smd 0.9 x 1.5: 17 -6.75,-15.25; 18 -5.25,-15.25; 19 -3.75,-15.25; 20 -2.25,-15.25; 21 -0.75,-15.25; 22 0.75,-15.25; 23 2.25,-15.25; 24 3.75,-15.25; 25 5.25,-15.25; 26 6.75,-15.25 | smd 1.1 x 1.1: 43 -1.19,-0.05; 44 -1.19,-1.55; 45 0.31,-1.55; 46 0.31,-0.05; 47 0.31,1.45; 48 -1.19,1.45; 49 -2.69,1.45; 50 -2.69,-0.05; 51 -2.69,-1.55
CP2102 = smd 1 x 0.3: 1 -2.35,1.5; 2 -2.35,1; 3 -2.35,0.5; 4 -2.35,0; 5 -2.35,-0.5; 6 -2.35,-1; 7 -2.35,-1.5; 15 2.35,-1.5; 16 2.35,-1; 17 2.35,-0.5; 18 2.35,0; 19 2.35,0.5; 20 2.35,1; 21 2.35,1.5 | smd 0.3 x 1: 8 -1.5,-2.35; 9 -1,-2.35; 10 -0.5,-2.35; 11 0,-2.35; 12 0.5,-2.35; 13 1,-2.35; 14 1.5,-2.35; 22 1.5,2.35; 23 1,2.35; 24 0.5,2.35; 25 0,2.35; 26 -0.5,2.35; 27 -1,2.35; 28 -1.5,2.35 | smd 3.35 x 3.35: 29 0,0
MAX485 = smd 1.525 x 0.65: 1 -2.712,1.905; 2 -2.712,0.635; 3 -2.712,-0.635; 4 -2.712,-1.905; 5 2.712,-1.905; 6 2.712,-0.635; 7 2.712,0.635; 8 2.712,1.905
SOT23-5V = smd 1.25 x 0.95: 1 -3.4,2.3; 2 -3.4,0; 3 -3.4,-2.3 | smd 1.25 x 3.2: 4 3.4,0
W5500 = smd 1.475 x 0.3: 1 -4.238,2.75; 2 -4.238,2.25; 3 -4.238,1.75; 4 -4.238,1.25; 5 -4.238,0.75; 6 -4.238,0.25; 7 -4.238,-0.25; 8 -4.238,-0.75; 9 -4.238,-1.25; 10 -4.238,-1.75; 11 -4.238,-2.25; 12 -4.238,-2.75; 25 4.238,-2.75; 26 4.238,-2.25; 27 4.238,-1.75; 28 4.238,-1.25; 29 4.238,-0.75; 30 4.238,-0.25; 31 4.238,0.25; 32 4.238,0.75; 33 4.238,1.25; 34 4.238,1.75; 35 4.238,2.25; 36 4.238,2.75 | smd 0.3 x 1.475: 13 -2.75,-4.238; 14 -2.25,-4.238; 15 -1.75,-4.238; 16 -1.25,-4.238; 17 -0.75,-4.238; 18 -0.25,-4.238; 19 0.25,-4.238; 20 0.75,-4.238; 21 1.25,-4.238; 22 1.75,-4.238; 23 2.25,-4.238; 24 2.75,-4.238; 37 2.75,4.238; 38 2.25,4.238; 39 1.75,4.238; 40 1.25,4.238; 41 0.75,4.238; 42 0.25,4.238; 43 -0.25,4.238; 44 -0.75,4.238; 45 -1.25,4.238; 46 -1.75,4.238; 47 -2.25,4.238; 48 -2.75,4.238
RJ45 = drill 0.9 pad 1.4 square: 1 -4.445,6.45 | drill 0.9 pad 1.4: 2 -3.175,8.99; 3 -1.905,6.45; 4 -0.635,8.99; 5 0.635,6.45; 6 1.905,8.99; 7 3.175,6.45; 8 4.445,8.99 | drill 1.02 pad 1.53: 9 -6.325,-4.98; 10 -3.785,-3.28; 11 3.785,-4.98; 12 6.325,-3.28 | drill 1.6 pad 2.4: 13 -7.875,3.15; 14 7.875,3.15 | hole 3.25: -5.715,0.1; 5.715,0.1
61300411121 = drill 1.1 square: 1 -3.81,0 | drill 1.1: 2 -1.27,0; 3 1.27,0; 4 3.81,0
SMD3225_4P16MHZ20PF10PPM4085 = smd 1.4 x 1.2: 1 -1.1,-0.85; 2 1.1,-0.85; 3 1.1,0.85; 4 -1.1,0.85
CHIPLED_0603 = smd 0.8 x 0.8: A 0,-0.75; C 0,0.75
SOT23 = smd 1 x 1.4: 1 -0.95,-1.1; 2 0.95,-1.1; 3 0,1.1
R0603 = smd 1 x 1.1: 1 -0.85,0; 2 0.85,0
R0805 = smd 1.3 x 1.5: 1 -0.95,0; 2 0.95,0
MSK12C02 = smd 0.5 x 1: A1 -2.25,1.85; B1 0.75,1.85; C1 2.25,1.85 | smd 0.8 x 0.5: MP1 3.45,1.05; MP2 3.45,-1.05; MP3 -3.45,-1.05; MP4 -3.45,1.05 | hole 0.85: -1.5,0; 1.5,0
SMDBUTTON = smd 1.55 x 1.3: T1 -3.975,2.25; T2 3.975,2.25; T3 -3.975,-2.25; T4 3.975,-2.25
SOT23-EBC = smd 1 x 1.4: B 0.95,-1.1; C 0,1.1; E -0.95,-1.1
1751248 = drill 1.1 pad 1.7: 1 -1.75,-0.1; 2 1.75,-0.1
FC135R = smd 1 x 1.8: 1 -1.25,0; 2 1.25,0
ABM325000MHZB2T = smd 1.9 x 2.4: 1 -2.05,0; 2 2.05,0

### Placement (x,y rotation side)
C1  78.36,53.47 90 top
C2  65.28,38.61 270 top
C3  48.26,50.8 90 top
C4  48.26,46.99 270 top
C5  37.34,56.52 0 top
C6  53.34,39.37 270 top
C7  49.53,39.37 270 top
C8  69.47,40.01 0 top
C9  59.69,39.37 180 top
C10  74.93,53.34 90 top
C11  72.39,53.34 90 top
C12  58.04,56.9 0 top
C13  53.34,53.34 90 top
C14  4.57,28.19 0 top
C15  83.06,38.99 270 top
C16  83.95,34.04 90 top
C17  3.94,40.64 180 top
C18  19.05,61.34 90 top
C19  16,61.21 90 top
C20  21.72,64.52 90 top
C21  33.02,57.15 270 top
C23  35.56,27.94 270 top
C24  35.56,44.45 90 top
C25  24.77,6.48 270 top
C26  22.23,10.03 180 top
C28  75.69,57.78 270 top
C29  75.56,62.36 90 top
C30  75.31,68.33 270 top
C31  60.58,23.62 90 top
C32  55.12,28.96 180 top
C33  66.04,19.05 0 top
C34  66.04,15.24 0 top
C35  54.61,2.54 270 top
C36  50.8,2.54 90 top
C37  72.39,7.62 0 top
C38  66.04,7.62 180 top
C39  66.04,11.43 180 top
C40  72.39,15.24 0 top
C41  63.5,2.54 270 top
C42  72.39,11.43 0 top
C43  74.93,2.54 270 top
C44  61.72,9.91 90 top
C45  61.21,5.71 180 top
CN1  93.47,49.4 90 top
CN2  4.32,8.38 270 top
D1  80.14,26.42 0 top
D2  82.93,43.69 0 top
D3  16.51,3.81 180 top
D4  75.82,39.5 90 top
D5  5.08,60.96 0 top
FB1  45.72,40.64 0 top
FB2  80.64,32.89 270 top
FB4  46.99,2.54 270 top
IC1  62.23,48.26 0 top
IC2  80.39,48.9 180 top
IC3  89.92,37.97 0 top
IC4  21.59,36.83 180 top
IC5  16.13,9.4 0 top
IC6  22.86,15.24 0 top
IC7  64.77,66.04 90 top
IC8  81.79,65.15 0 top
IC9  52.07,11.43 90 top
J1  88.9,11.43 90 top
J2  8.38,35.81 90 top
L1  43.18,48.26 270 top
LED1  67.31,27.94 0 top
LED2  84.07,57.78 0 top
Q1  86.87,27.81 270 top
R1  51.56,47.88 0 top
R2  36.96,61.21 0 top
R3  74.3,31.88 90 top
R4  69.85,29.21 90 top
R5  4.32,32.38 180 top
R6  4.95,36.96 270 top
R7  19.56,56.52 270 top
R8  16.38,56.39 270 top
R9  3.81,66.04 180 top
R10  26.04,57.15 270 top
R11  29.21,57.15 270 top
R12  22.86,57.15 90 top
R13  30.48,12.7 180 top
R14  30.48,16.51 180 top
R15  32.13,6.35 90 top
R16  28.7,6.22 90 top
R17  36.83,20.32 90 top
R18  45.72,21.59 270 top
R19  35.56,33.02 270 top
R20  5.59,21.72 270 top
R21  69.85,66.04 270 top
R22  88.52,68.83 90 top
R23  88.52,62.99 270 top
R24  69.85,60.96 0 top
R26  69.85,57.15 0 top
R27  59.69,60.71 180 top
R28  80.9,57.28 90 top
R29  53.34,19.05 0 top
R30  58.42,2.54 270 top
R31  43.18,13.97 180 top
R32  43.05,10.16 180 top
R33  43.18,6.35 180 top
R34  71.12,2.54 90 top
R35  43.18,3.81 180 top
R36  67.31,2.54 90 top
R37  38.1,12.7 180 top
R38  38.1,8.89 180 top
R39  36.83,5.08 180 top
R40  72.39,19.05 0 top
R41  72.39,22.86 0 top
R42  63.37,57.78 270 top
R43  66.29,59.05 270 top
S1  35.56,69.72 180 top
S2  45.72,60.96 90 top
S3  4.45,49.53 90 top
S4  45.72,31.75 0 top
T1  41.91,17.78 270 top
T2  40.64,24.13 90 top
X1  94.61,27.56 90 top
X2  94.61,65.91 90 top
Y1  26.16,62.48 0 top
Y2  54.61,24.13 0 top

### Tracks (layer width: path | path; a pad name or v marks a point on that pad's centre or on a via)
3V3A
  Top 0.254: 61.65,10.68 IC9.17 55.36,10.68 54.61,11.43 54.61,12.06 55.23,12.68 IC9.21 | 61.65,10.68 C44.2 | 61.65,10.68 60.65,9.68 59.69,9.68 IC9.15 54.89,9.68 54.32,9.11 54.32,8.54 | IC9.4 50.82,8.4 51.18,8.76 52.2,8.76 | IC9.8 52.82,8.14 52.2,8.76 | 54.32,8.54 IC9.11 54.32,5.5 55.12,4.7 55.12,3.9 C35.1 | 52.2,8.76 54.1,8.76 54.32,8.54
  Top 0.3: C35.1 53.43,3.39 51.73,1.69 C36.1 47.04,1.69 FB4.2 | R38.2 37.25,7.66 35.98,6.39 R39.2 | 59.69,9.68 60.36,9.01 C45.2
  Top 0.45: R37.2 R38.2 | R39.2 36.45,4.61 36.45,2.54 37.3,1.69 47.04,1.69
+3V3  (via drill 0.35)
  Top 0.254: IC1.1 53.82,52.01 C13.1 | IC1.64 58.48,55.19 57.78,55.88 57.53,55.88 57.19,56.22 C12.1 | IC1.48 71.91,52.01 C11.1 | IC1.32 65.98,41.08 67.06,40.01 C8.1 | IC1.19 59.48,41.1 60.54,40.04 C9.1 | IC9.28 53.32,12.59 | 53.32,12.59 v53.34,12.57 | IC9.43 49.4,11.18 49.66,10.92 49.66,10.67 | 49.66,10.67 49.66,10.29 | 49.66,10.29 49.53,10.16 47.85,10.16 IC9.45 | IC9.44 49.65,10.68 49.66,10.67 | 49.66,10.29 51.01,10.29 53.32,12.59 | R14.1 32.7,17.78 v33.02,17.78 | IC6.6 IC6.7 19.84,13.74 v18.92,12.83 | v43.18,40.64 FB1.1 44.45,41.11 v44.45,41.91 | C33.1 64.9,19.24 v64.9,21.08
  Top 0.3: v82.93,36.96 83.06,37.08 C15.2 83.02,38.1 v81.53,38.1 | IC4.2 34.02,30.33 C23.1 35.98,28.79 v38.1,26.67 | S1.A1 42.47,67.87 v43.18,68.58 | R12.2 v22.86,59.69 | C24.1 33.44,43.6 v33.02,43.18 | C34.1 63.12,15.24 v62.61,15.75
  Top 0.45: C26.1 32.89,10.03 33.66,10.79 33.66,15.24 32.38,16.51 R14.1 | R5.2 2.83,33.02 v1.27,33.02 | FB4.1 48.48,3.34 v48.51,3.3 | C9.1 61.72,38.19 v61.72,37.59 | C8.1 68.62,38.27 v68.58,38.23 | C13.1 52.03,52.49 v51.31,53.21 | C12.1 55.88,56.9 v55.37,57.4 | C11.1 70.57,52.49 v70.1,52.96
  Top 0.6: C15.2 86.4,38.14 IC3.2 | C11.1 C10.1
  Top 0.61: LED1.A 67.31,25.91 v67.18,25.78
  Bottom 0.45: J1.12 J1.10
  pour Bottom: -1.27,76.2 -5.08,72.39 -5.08,-5.08 -1.27,-8.89 106.68,-8.89 110.49,-5.08 110.49,77.47 109.22,78.74 2.54,78.74 1.27,78.74
+5V  (via drill 0.35)
  Top 0.45: R24.2 R26.2 | R24.2 71.15,61.41 C29.1 | R27.2 58.84,69 59.69,69.85 62.23,69.85 62.87,69.22 IC7.8 62.87,66.67 v63.5,66.04 | R24.2 70.7,63.21 v70.74,63.25
  Top 0.6: R23.2 88.52,61.47 87,59.94 82.72,59.94 R28.2 80.39,58.63 C28.1 75.69,61.28 | C29.1 75.69,61.28 | IC8.3 76.82,61.28 75.69,61.28
  Bottom 0.45: v70.74,63.25 67.94,66.04 v63.5,66.04
ACTLED  (via drill 0.35)
  Top 0.254: IC9.27 53.82,16.74 54.86,17.78 v55.88,17.78 | v70.23,18.8 70.48,19.05 R40.1
  Route15 0.254: v70.23,18.8 69.22,17.78 v55.88,17.78
B
  Top 0.3: IC4.27 12.7,51.47 12.7,60.96 11.2,62.46 D5.2
BOOT0  (via drill 0.35)
  Top 0.254: IC1.60 60.48,57.38 v60.33,57.53 | R2.2 39.12,61.21 v39.37,60.96
  Route15 0.254: v60.33,57.53 56.9,60.96 v39.37,60.96
CHIP_EN
  Top 0.254: R6.2 4.95,32.6 R5.1 5.17,28.45 C14.2 | R20.1 5.59,28.03 C14.2 | C14.2 8.38,28.19 10.52,30.33 IC4.41
CLK
  Top 0.254: J2.4 11.09,42.33 IC4.33
CRXD
  Top 0.3: IC4.37 17.01,36.33 22.86,30.48 IC6.25
CTXD
  Top 0.3: IC6.26 22.36,28.44 15.97,34.83 IC4.38
D_N
  Top 0.254: IC2.1 87.31,47.95 87.97,48.6 CN1.D-
D_P
  Top 0.254: IC2.3 87.31,49.84 87.76,49.4 CN1.D+
DD  (via drill 0.35)
  Top 0.254: IC1.49 65.98,54.93 66.18,55.13 66.29,55.13 66.4,55.24 67.69,55.24 69,56.55 R26.1
  Top 0.3: IC7.3 IC7.2 v64.14,61.34 | R26.1 68.58,57.57 v68.58,58.42
  Route15 0.3: v64.14,61.34 64.14,60.45 65.41,59.18 67.82,59.18 v68.58,58.42
DI
  Top 0.254: R24.1 67.6,59.56 66.64,59.56 R43.1
  Top 0.3: IC7.4 66.67,61.98 67.69,60.96 R24.1
DTR  (via drill 0.35)
  Top 0.254: IC6.28 21.36,19.03 v21.08,19.3 | v34.29,20.32 35.24,21.27 R17.2
  Top 0.3: R17.2 36.83,22.73 38.23,24.13 T2.C
  Route15 0.254: v21.08,19.3 21.08,19.81 21.59,20.32 v34.29,20.32
EN_AUTO  (via drill 0.35)
  Top 0.254: T1.C v44.45,17.78 | v7.62,17.78 5.59,19.81 R20.2
  Route15 0.254: v44.45,17.78 34.29,7.62 17.78,7.62 v7.62,17.78
ESP_N  (via drill 0.35)
  Top 0.254: IC6.5 18.55,14.74 17.78,13.97 17.78,10.75 IC5.6 17.14,10.58 v17.14,11.81 | C18.1 20.41,60.49 v20.95,59.94
  Top 0.3: C18.1 19.05,57.87 R7.1
  Route15 0.254: v20.95,59.94 20.95,45.09 17.78,41.91 17.78,19.81 15.88,17.91 15.88,13.08 v17.14,11.81
ESP_P  (via drill 0.35)
  Top 0.254: IC6.4 17.53,15.24 16.13,13.84 16.13,11.43 | 16.13,11.43 16.13,9.02 16.7,8.45 IC5.4 | 16.13,11.43 14.61,12.95 v14.61,13.97 | v14.35,56.9 14.69,57.24 R8.1
  Top 0.3: C19.1 16,57.62 R8.1
  Route15 0.254: v14.61,13.97 14.61,19.68 16.51,21.59 16.51,53.34 14.35,55.5 v14.35,56.9
G
  Top 0.3: IC4.29 11.74,48.33 10.16,49.91 10.16,58.42 9.12,59.46 D5.6
GND  (via drill 0.35)
  Top 0.254: IC1.63 58.98,56.8 C12.2 | IC1.18 58.98,39.51 C9.2 | IC1.12 58.7,46.51 v58.8,46.61 | S2.T3 50.63,56.98 v50.8,57.15 | IC9.29 52.82,13.96 v52.2,13.34 | IC9.16 56.29,10.16 53.03,10.16 v52.96,10.23 51.6,10.23 51.2,9.83 50.68,9.83 49.53,8.68 | IC9.19 58.8,11.68 v59.05,11.43 | IC9.14 58.26,9.18 v59.05,8.38 | IC9.9 53.32,5.95 v52.58,5.21 | S3.T1 3.09,44.66 C17.2 3.09,39.16 v2.54,38.61 | IC6.3 18.55,15.74 v17.78,16.51 | IC9.48 49.53,8.68 | 49.53,8.68 49.99,8.68 50.32,8.35 IC9.3 | 21.45,38.24 21.59,38.24 21.59,38.38 | C14.1 3.72,26.96 v2.92,26.16 | 21.34,15.53 21.34,15.49 | 21.34,15.49 21.59,15.24 21.34,15.49 | IC6.3 22.36,15.74 IC6.29 | 21.34,15.53 21.34,15.49 | IC6.3 21.12,15.74 | 21.12,15.74 21.34,15.53 | 21.34,15.53 21.34,15.49 | IC6.3 21.12,15.74 | 21.12,15.74 21.34,15.53
  Top 0.3: L1.4 44.03,49.11 42.33,47.41 L1.2 | C35.2 R30.2 59.6,1.69 v60.58,2.67 61.56,1.69 C41.2 | IC2.2 v83.82,48.9 | CN1.GND 87.43,51 v87.12,51.31 | v81.66,40.01 81.83,39.84 C15.1 83.06,40.77 v83.44,41.15 | v85.85,33.02 84.11,33.02 C16.1 83.95,32.13 84.07,32 v84.2,31.88 | C31.1 60.58,22.1 v59.69,21.21 | C32.1 57.91,28.96 v58.04,28.83 | S4.T1 39.37,36.38 v39.37,36.83 | v35.56,25.4 C23.2 33.82,28.83 IC4.1 29.64,29.53 29.45,29.53 26.67,32.3 26.67,35.56 25.4,36.83 | IC4.42 14.35,28.83 v15.24,27.94 | IC4.45 21.59,38.38 21.45,38.24 21.28,38.07 | IC4.51 24.13,38.38 | IC4.26 13.72,53.2 v13.72,54.99 | C18.2 16.13,62.19 C19.2 16.51,62.57 v16.51,63.5 | C18.2 19.05,62.7 C20.2 21.59,65.49 v21.59,67.31 | C18.2 19.05,64.14 v18.67,64.52 | v6.35,66.04 R9.1 5.08,66.36 v5.08,68.58 | S1.C1 32.87,67.44 v29.84,67.44 | C21.2 36.27,56.3 C5.1 36.49,54.95 v36.83,54.61 | C24.2 33.44,45.3 v33.02,45.72 | C26.2 20.74,10.67 v19.3,10.67 | R13.1 29.4,14.73 v28.19,14.73 | C4.2 47.33,45.21 v46.61,45.21 | C3.2 47.71,52.2 v45.97,52.2 | LED2.C 85.97,58.53 v85.98,58.55 | v91.44,71.12 90,69.68 R22.2 88.35,69.85 v77.47,69.85 75.89,69.85 C30.1 74.74,69.85 v73.66,69.85 67.77,69.85 IC7.5 | C29.2 77.41,65.15 IC8.2 | C29.2 73.85,63.31 v73.66,63.5 | C29.2 75.06,63.81 v75.06,65.28 | C43.1 v74.93,5.08 | C42.1 72.11,11.99 v72.11,13.08 | C34.2 C33.2 68.07,20.13 v68.07,21.08 | C34.2 66.99,11.53 C39.1 C38.1 66.89,5.8 v66.8,5.71 62.23,5.71 | C34.2 67.75,16 v68.96,16 | C45.1 62.23,5.71 | C44.1 62.23,8.55 62.23,5.71
  Top 0.45: CN2.GND 10.11,6.78 v10.92,5.97 | IC5.2 13.34,9.4 v13.21,9.53 | C25.2 24.77,4.19 v24.51,3.94 | R16.1 28.7,4.19 v28.07,3.56 | C36.2 52.58,5.17 v52.58,5.21 | v49.53,36.83 C7.2 C6.2 v53.34,36.83 | C2.2 65.28,36.07 v65.41,35.94 | C9.2 57.7,38.23 v56.77,38.23 | C8.2 70.32,41.87 v70.48,42.04 | C13.2 v53.34,55.88 | C12.2 56.09,59.69 v55.88,59.69 | v73.66,57.02 73.75,56.94 C28.2 74.93,56.17 C10.2 | C11.2 71.59,54.99 v70.74,54.99 | C1.2 80.1,54.32 v80.14,54.36 | 84.07,32 84.07,30.46 Q1.1 86.11,29.1 v86.11,30.48 | L1.2 42.33,45 v42.16,44.83
  Top 0.6: C15.1 86.14,39.84 IC3.1 | C11.2 C10.2 75.06,54.32 C1.2 | R16.1 28.35,5.63 C25.2 22.31,5.63 21.59,6.35 21.59,9.82 C26.2
  Top 0.61: v74.3,29.08 R3.1 70.62,30.93 R4.2 v69.85,32.38
  pour Route2: -1.27,72.39 -1.27,-2.54 1.27,-5.08 97.79,-5.08 104.14,1.27 104.14,72.39 101.6,74.93 1.27,74.93
  pour Top: 20.32,39.37 20.32,34.29 25.4,34.29 25.4,39.37
HSE_IN
  Top 0.254: IC1.5 48.32,50.01 C3.1 48.22,49.91 46.61,49.91 45.72,50.8 43.18,50.8 42.33,49.95 L1.1
HSE_OUT
  Top 0.254: R1.2 52.96,47.88 54.59,49.51 IC1.6
IO0
  Top 0.3: S4.T3 37.27,33.97 R19.1 33.97,33.97 31.83,31.83 IC4.3
IO0_AUTO
  Top 0.3: T2.E 40.64,24.28 40.64,26.99 R19.2
IO18
  Top 0.3: IC4.21 22.34,54.09 22.86,54.61 R12.1
LED_B
  Top 0.254: IC1.33 73.09,44.51 74.32,43.28 D4.2
LED_G
  Top 0.254: IC1.35 75.9,45.51 77.32,44.09 D4.6
LED_R
  Top 0.254: IC1.34 75.26,45.01 75.82,44.45 D4.4
LINKLED  (via drill 0.35)
  Top 0.254: IC9.25 54.82,16.59 55.24,17.02 58.55,17.02 v60.2,18.67 | v69.85,22.86 R41.1
  Route15 0.254: v60.2,18.67 64.39,22.86 v69.85,22.86
MISO  (via drill 0.35)
  Top 0.254: IC1.52 64.48,55.59 65.66,56.77 v66.42,56.77 | IC9.34 50.32,18.13 49.4,19.05 49.4,20.19 v49.53,20.32
  Route15 0.254: v49.53,20.32 45.72,24.13 45.72,38.23 64.26,56.77 v66.42,56.77
MOSI  (via drill 0.35)
  Top 0.254: IC1.57 61.98,55.37 v61.47,55.88 | IC9.35 49.82,17.36 v48.64,18.54
  Route15 0.254: v61.47,55.88 43.56,37.97 43.56,23.62 v48.64,18.54
N$1
  Top 0.61: X1.2 93.22,27.81 Q1.3
N$2
  Top 0.61: FB2.2 78.49,29.93 D1.1
N$3
  Top 0.61: D1.2 85.32,26.42 Q1.2
N$4
  Top 0.61: D4.5 D4.3 D4.1 74.32,32.85 R3.2
N$5
  Top 0.3: S1.B1 34.81,62.51 R2.1
N$6
  Top 0.61: R4.1 67.74,28.26 LED1.C
N$8
  Top 0.254: S3.T3 6.7,42.55 C17.1 4.79,37.97 R6.1
N$10
  Top 0.254: CN2.D- 11.72,9.18 12.89,10.35 IC5.1
N$11
  Top 0.254: CN2.D+ 8.45,8.45 IC5.3
N$12  (via drill 0.35)
  Top 0.45: CN2.VBUS 9.98,9.98 v10.67,10.67 | v12.57,4.83 13.59,3.81 D3.2
  Route2 0.45: v10.67,10.67 12.57,8.76 v12.57,4.83
N$13
  Top 0.6: D2.2 88.7,47.8 CN1.VBUS
N$14
  Top 0.3: IC4.22 20.84,53.45 19.56,54.74 R7.2
N$15
  Top 0.3: IC4.23 19.34,52.92 16.73,55.54 R8.2
N$16
  Top 0.254: IC4.18 26.84,52.75 29.21,55.12 R11.2
N$17
  Top 0.254: IC1.31 65.48,39.66 C2.1
N$18
  Top 0.254: IC1.47 77.25,51.51 C1.1
N$19
  Top 0.254: IC4.19 25.34,55.6 R10.2
N$20
  Top 0.254: L1.3 45.64,47.16 46.32,47.84 C4.1 50.67,47.84 R1.1
N$21
  Top 0.254: R10.1 24.91,59.12 Y1.1 23.73,63.67 C20.1
N$22
  Top 0.254: Y1.2 27.41,59.8 R11.1 C21.1
N$23  (via drill 0.35)
  Top 0.254: C25.1 24.77,8.51 v25.02,8.76 | IC6.8 21.36,12.22 v20.83,11.68
  Top 0.6: C25.1 28.55,7.33 R16.2 32,7.17 R15.2
  Route15 0.254: v25.02,8.76 21.21,8.76 20.83,9.14 v20.83,11.68
N$24
  Top 0.254: IC6.11 22.86,11.81 23.24,11.43 28.26,11.43 R13.2
N$25
  Top 0.254: IC6.9 21.86,11.79 22.68,10.98 28.45,10.98 28.52,11.05 32.77,11.05 33.02,11.3 33.02,14.1 32.26,14.86 30.73,14.86 29.53,16.06 R14.2
N$26
  Top 0.3: D5.1 2.88,62.23 | 2.88,62.23 D5.3 D5.5 | R9.2 2.86,62.25 2.88,62.23
N$29
  Top 0.3: R17.1 36.83,17.78 37.78,16.83 T1.B
N$30
  Top 0.3: R18.1 43.18,25.08 T2.B
N$31
  Top 0.254: IC9.22 64.29,13.18 65.19,12.28 C39.2
N$32
  Top 0.254: IC9.20 62.75,12.18 63.5,11.43 63.5,9.31 C38.2
N$33
  Top 0.3: R28.1 83.47,56.43 LED2.A
N$34  (via drill 0.35)
  Top 0.254: IC9.10 53.82,4.85 v53.85,4.83 | v57.66,4.7 58.42,3.94 R30.1
  Route15 0.254: v53.85,4.83 57.53,4.83 v57.66,4.7
N$35  (via drill 0.35)
  Top 0.254: R31.1 v45.72,13.97 46.23,13.46 46.23,6.22 46.61,5.84 49.15,5.84 49.32,6.01 IC9.1
N$36
  Top 0.254: R32.1 45.21,10.16 45.77,9.6 45.77,6.04 46.42,5.39 49.34,5.39 49.8,5.85 49.8,7.17 IC9.2
N$37
  Top 0.254: IC9.5 51.3,7.17 51.3,6.32 49.91,4.93 46.23,4.93 44.82,6.35 R33.1
N$38
  Top 0.254: IC9.6 51.8,7.17 51.8,6.18 49.94,4.32 44.54,4.32 R35.1
N$39  (via drill 0.35)
  Top 0.3: R32.2 42.2,8.85 v42.67,8.38
  Top 0.45: R38.1 40.22,10.16 R32.2
  Bottom 0.3: v42.67,8.38 44.45,6.6 82.07,6.6 J1.1
N$40  (via drill 0.35)
  Top 0.254: R37.1 41.06,12.7 R31.2 43.69,12.61 v43.69,12.19
  Bottom 0.254: v43.69,12.19 44.45,12.19 47.12,9.53 J1.3
N$41
  Top 0.3: C40.2 78,15.24 J1.6
N$42  (via drill 0.35)
  Top 0.3: C37.2 v76.2,7.62
  Route15 0.3: v76.2,7.62 79.38,10.79 J1.4
N$43  (via drill 0.35)
  Top 0.3: C37.1 71.12,7.2 R34.2 69.55,3.39 v69.15,2.99 | R35.2 41.4,3.81 v41.02,4.19
  Route15 0.3: v41.02,4.19 41.02,2.79 42.55,1.27 67.43,1.27 v69.15,2.99
N$44  (via drill 0.35)
  Top 0.3: C40.1 71.12,15.24 69.85,13.97 69.85,5.93 R36.2 66.76,3.94 v65.41,3.94 | R33.2 40.89,6.35 v40.26,6.99
  Route15 0.3: v40.26,6.99 45.09,2.16 58.17,2.16 59.94,3.94 v65.41,3.94
N$45  (via drill 0.35)
  Top 0.3: v73.03,0.89 72.22,1.69 R34.1 R36.1 65.2,1.69 C41.1
  Route2 0.3: v73.03,0.89 75.95,3.81 82.55,3.81 85.09,6.35 85.09,9.43 J1.5
N$46
  Top 0.3: J1.9 92.64,5.11 89.75,8 88.9,8 83.57,13.34 81.79,13.34 80.39,14.73 79.5,14.73 75.18,19.05 R40.2
N$47  (via drill 0.35)
  Top 0.254: v75.56,11.43 C42.2
  Top 0.3: v75.56,11.43 78.74,8.26 J1.2 | R39.1 v39.37,5.08
  Route15 0.254: 73.66,11.43 v75.56,11.43
  Route15 0.3: v39.37,5.08 39.75,5.08 40.13,4.7 40.13,2.16 41.53,0.76 68.58,0.76 73.66,5.84 73.66,11.43
N$48
  Top 0.45: R41.2 77.47,22.86 85.54,14.79 89.78,14.79 90.2,15.21 J1.11
NRST  (via drill 0.35)
  Top 0.254: IC1.7 59.17,49.01 v59.69,49.53 | S2.T1 45.21,55.24 v45.34,55.24
  Top 0.3: C5.2 43,56.52 S2.T1
  Bottom 0.254: v59.69,49.53 58.42,50.8 52.07,50.8 49.53,53.34 47.24,53.34 v45.34,55.24
R
  Top 0.3: D5.4 9.91,60.96 11.3,59.56 11.3,50.93 12.4,49.83 IC4.28
RO
  Top 0.254: R27.1 62.23,60.71 63.37,59.56 R42.1
  Top 0.3: IC7.1 62.87,63.03 R27.1
RS485_A  (via drill 0.35)
  Top 0.3: X2.1 94.39,63.84 88.9,63.84 R23.1 87.72,63.84 v86.74,62.87 | R21.1 71.84,66.89 v71.88,66.93
  Top 0.45: IC7.6 65.41,67.31 65.83,66.89 R21.1
  Route15 0.3: v71.88,66.93 72.9,67.94 81.66,67.94 v86.74,62.87
RS485_B  (via drill 0.35)
  Top 0.3: X2.2 94.39,67.98 R22.1 88.05,67.98 v86.74,66.67 | R21.2 71.79,65.19 v71.88,65.28
  Top 0.45: IC7.7 64.14,66.8 65.75,65.19 R21.2
  Route2 0.3: v71.88,65.28 73.28,66.67 v86.74,66.67
RTS
  Top 0.254: IC6.24 23.36,18.53 23.88,19.05 33.27,19.05 36.83,15.49 44.83,15.49 45.72,16.38 45.72,20.57 | 45.72,20.57 R18.2 | T1.E 40.81,18.97 42.42,20.57 45.72,20.57
SCLK  (via drill 0.35)
  Top 0.254: IC1.51 64.98,55.07 65.75,55.84 v66,55.84 | IC9.33 50.82,19.03 v50.8,19.05
  Route15 0.254: v50.8,19.05 50.8,20.32 46.99,24.13 46.99,38.1 64.73,55.84 v66,55.84
SCSN  (via drill 0.35)
  Top 0.254: IC9.32 51.32,18.3 51.66,18.64 51.66,20.55 v51.69,20.57 | IC1.26 62.98,40.76 v62.87,40.64
  Route15 0.254: v62.87,40.64 57.78,35.56 54.61,35.56 47.88,28.83 47.88,24.38 v51.69,20.57
TDI
  Top 0.254: J2.2 10.41,36.58 10.41,37.97 11.77,39.33 IC4.35
TDO
  Top 0.254: J2.3 12.13,40.83 IC4.34
TMS
  Top 0.254: IC4.36 11.79,37.83 10.92,36.96 10.92,32.77 10.16,32 J2.1
UART2_RX  (via drill 0.35)
  Top 0.254: IC1.17 58.48,41.46 57.78,40.77 v56.39,40.77 | v35.69,39.5 35.52,39.33 IC4.8
  Route2 0.254: v56.39,40.77 53.72,38.1 39.37,38.1 37.97,39.5 v35.69,39.5
UART2_TX  (via drill 0.35)
  Top 0.254: IC1.16 54.92,44.51 v54.61,44.2 | v34.29,38.1 34.02,37.83 IC4.7
  Bottom 0.254: v54.61,44.2 44.45,44.2 38.35,38.1 v34.29,38.1
UART5_RX
  Top 0.254: IC1.54 63.48,56.83 R42.2
UART5_TX
  Top 0.254: IC1.53 63.98,55.85 66.29,58.17 R43.2
USBD_N
  Top 0.254: IC1.44 75.79,50.01 75.82,50.04 76.2,50.04 78.29,47.95 IC2.6
USBD_P
  Top 0.254: IC1.45 76.87,50.51 77.6,49.78 79.08,49.78 IC2.4
VBUS  (via drill 0.35)
  Top 0.45: IC2.5 80.14,48.9 80.52,48.51 80.52,44.45 D2.1
  Top 0.6: D3.1 20.32,3.81 | 20.32,3.81 21.59,2.54 30.48,2.54 32.13,4.19 R15.1 | IC5.5 18.41,9.4 20.32,7.49 20.32,3.81
  Top 0.813: R15.1 33.72,3.81 v34.29,3.81 | v80.01,38.1 80.01,42.42 D2.1
  Route2 0.813: v34.29,3.81 36.83,1.27 66.04,1.27 71.12,6.35 71.12,15.24 77.47,21.59 77.47,36.83 78.74,38.1 v80.01,38.1
VDDA
  Top 0.254: IC1.13 54.9,46.01 53.34,44.45 C6.1
  Top 0.45: C6.1 C7.1 49.11,40.64 FB1.2
VIN  (via drill 0.35)
  Top 0.6: IC3.3 85.77,34.89 C16.2 82.64,34.89 81.44,33.69 FB2.1 | C30.2 78.31,67.38 IC8.1
  Top 0.61: IC8.1 79.61,67.45 81.28,65.79 v81.28,63.5 | IC3.3 87.84,36.96 v90.17,36.96
  Bottom 0.61: v81.28,63.5 85.09,59.69 85.09,44.45 90.17,39.37 v90.17,36.96
VSS
  Top 0.45: C43.2 83.89,1.69 J1.13
  Bottom 0.45: J1.8 83.34,19.3 J1.14 J1.13
XI
  Top 0.254: 56.66,21.52 R29.2 54.19,18.63 52.32,16.76 IC9.30
  Top 0.3: 56.66,21.52 Y2.2 57,24.47 C31.2
XO
  Top 0.254: IC9.31 51.82,17.02 52.56,17.76 52.56,19.12
  Top 0.3: R29.1 52.56,19.12 Y2.1 54.27,25.84 C32.2

### Text on the board
bPlace: By Tinashe | Drakula IIOT Interface Controller
tNames: RUN | DEBUG | B | STM32 BOOT MODE | RS485 | A | ESP32 STATUS | STM32 USB | ESP32 ENABLE | gff | STM32 STATUS | +12v | Power In | gff | GND | gff
bNames: CLK | TDO | TDI | TMS